# EAGLE board trig3_board_de0-nano_lvds (EAGLE 9.6.2), part 1 of 2
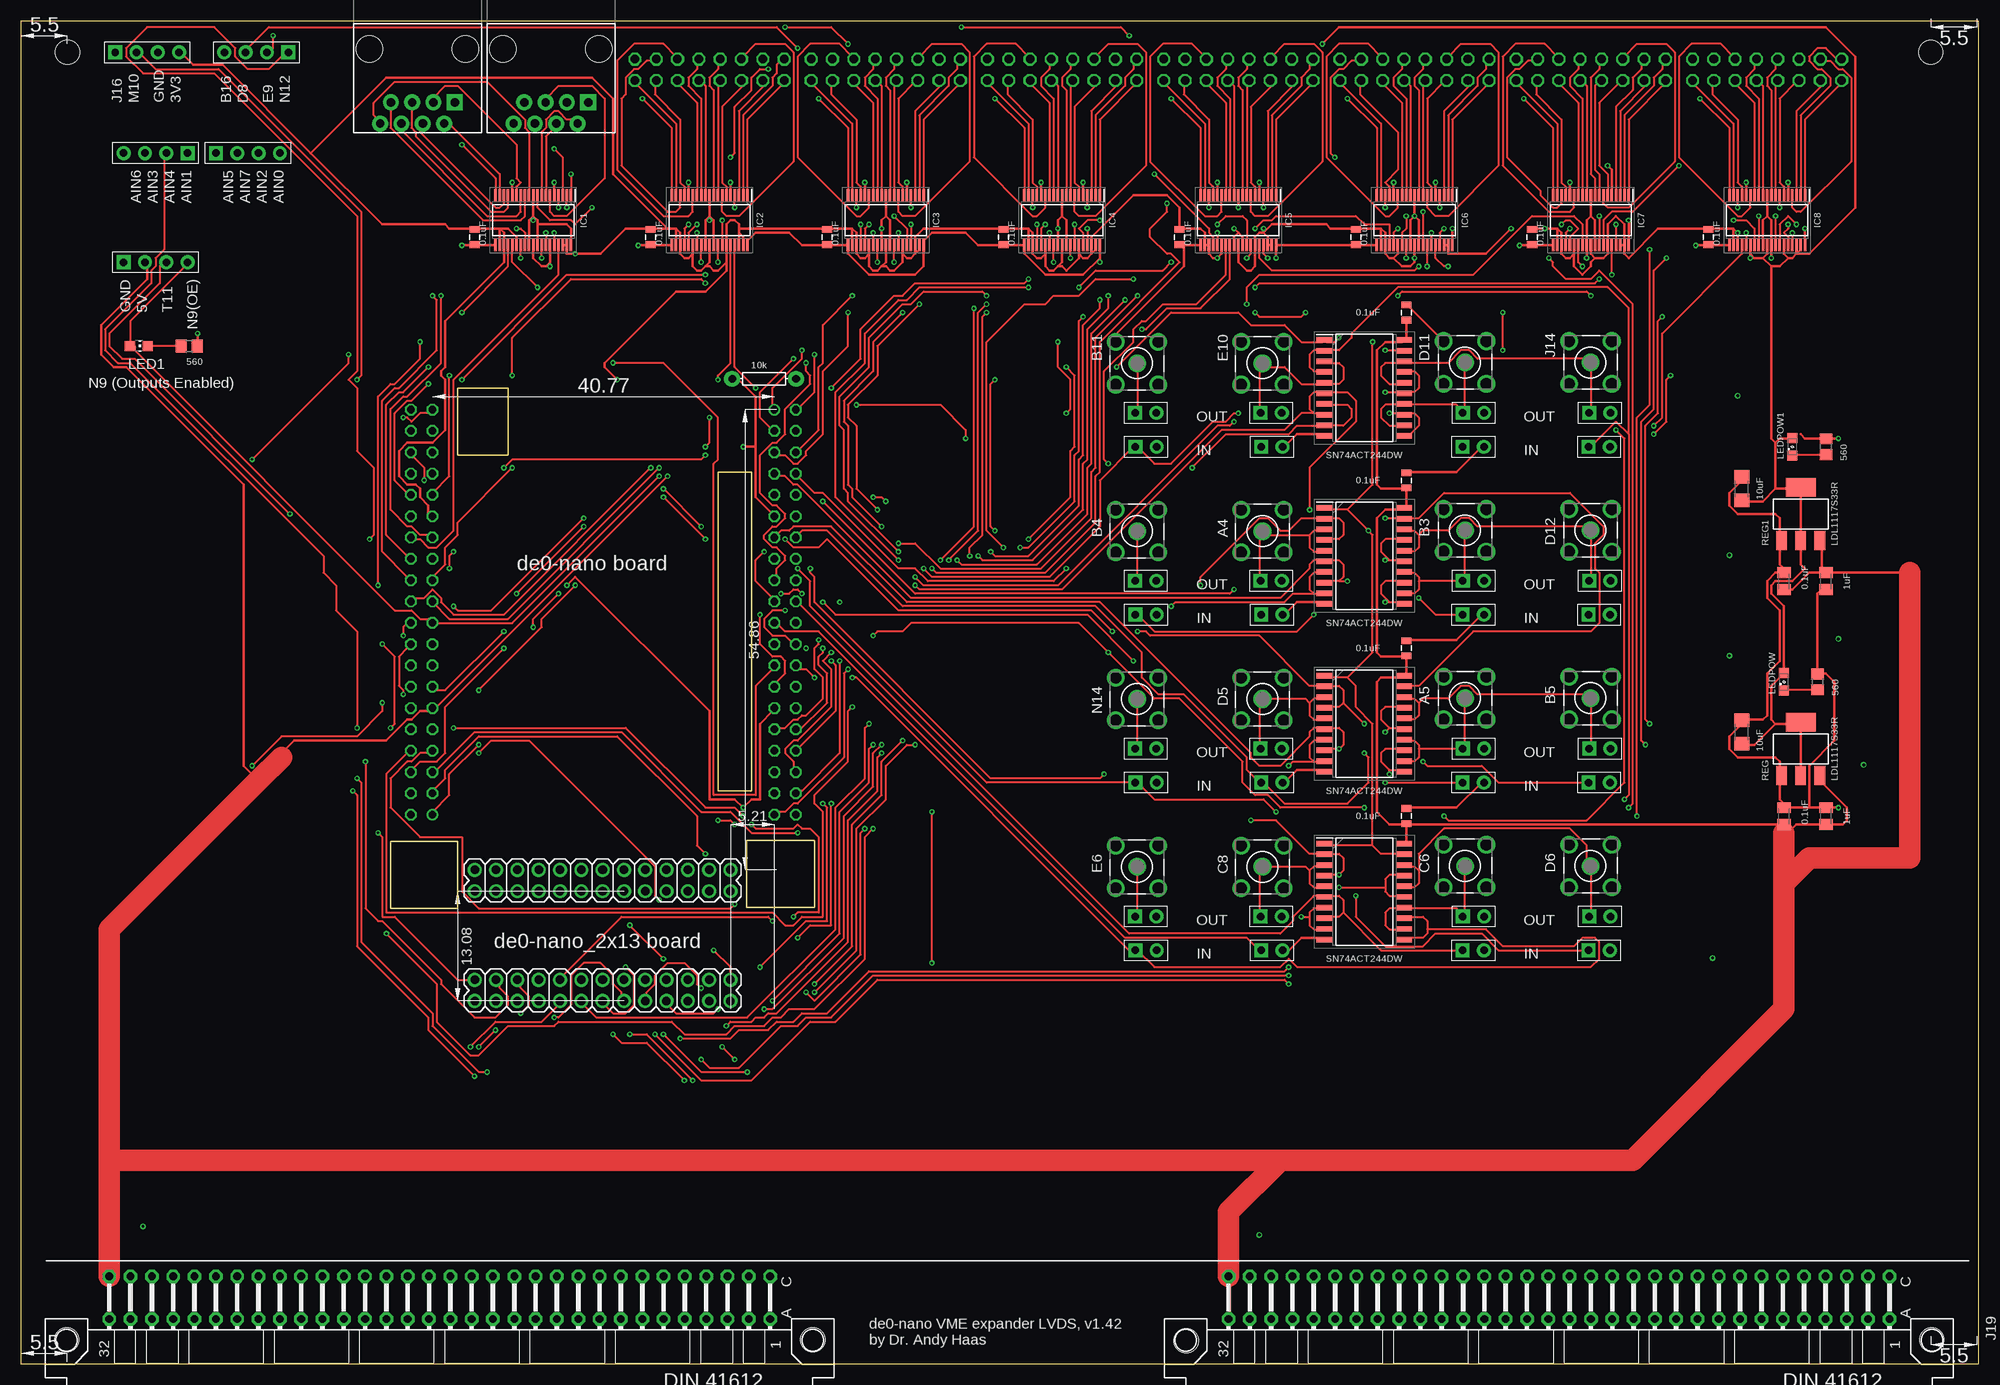
[diagram p2: board, top side]
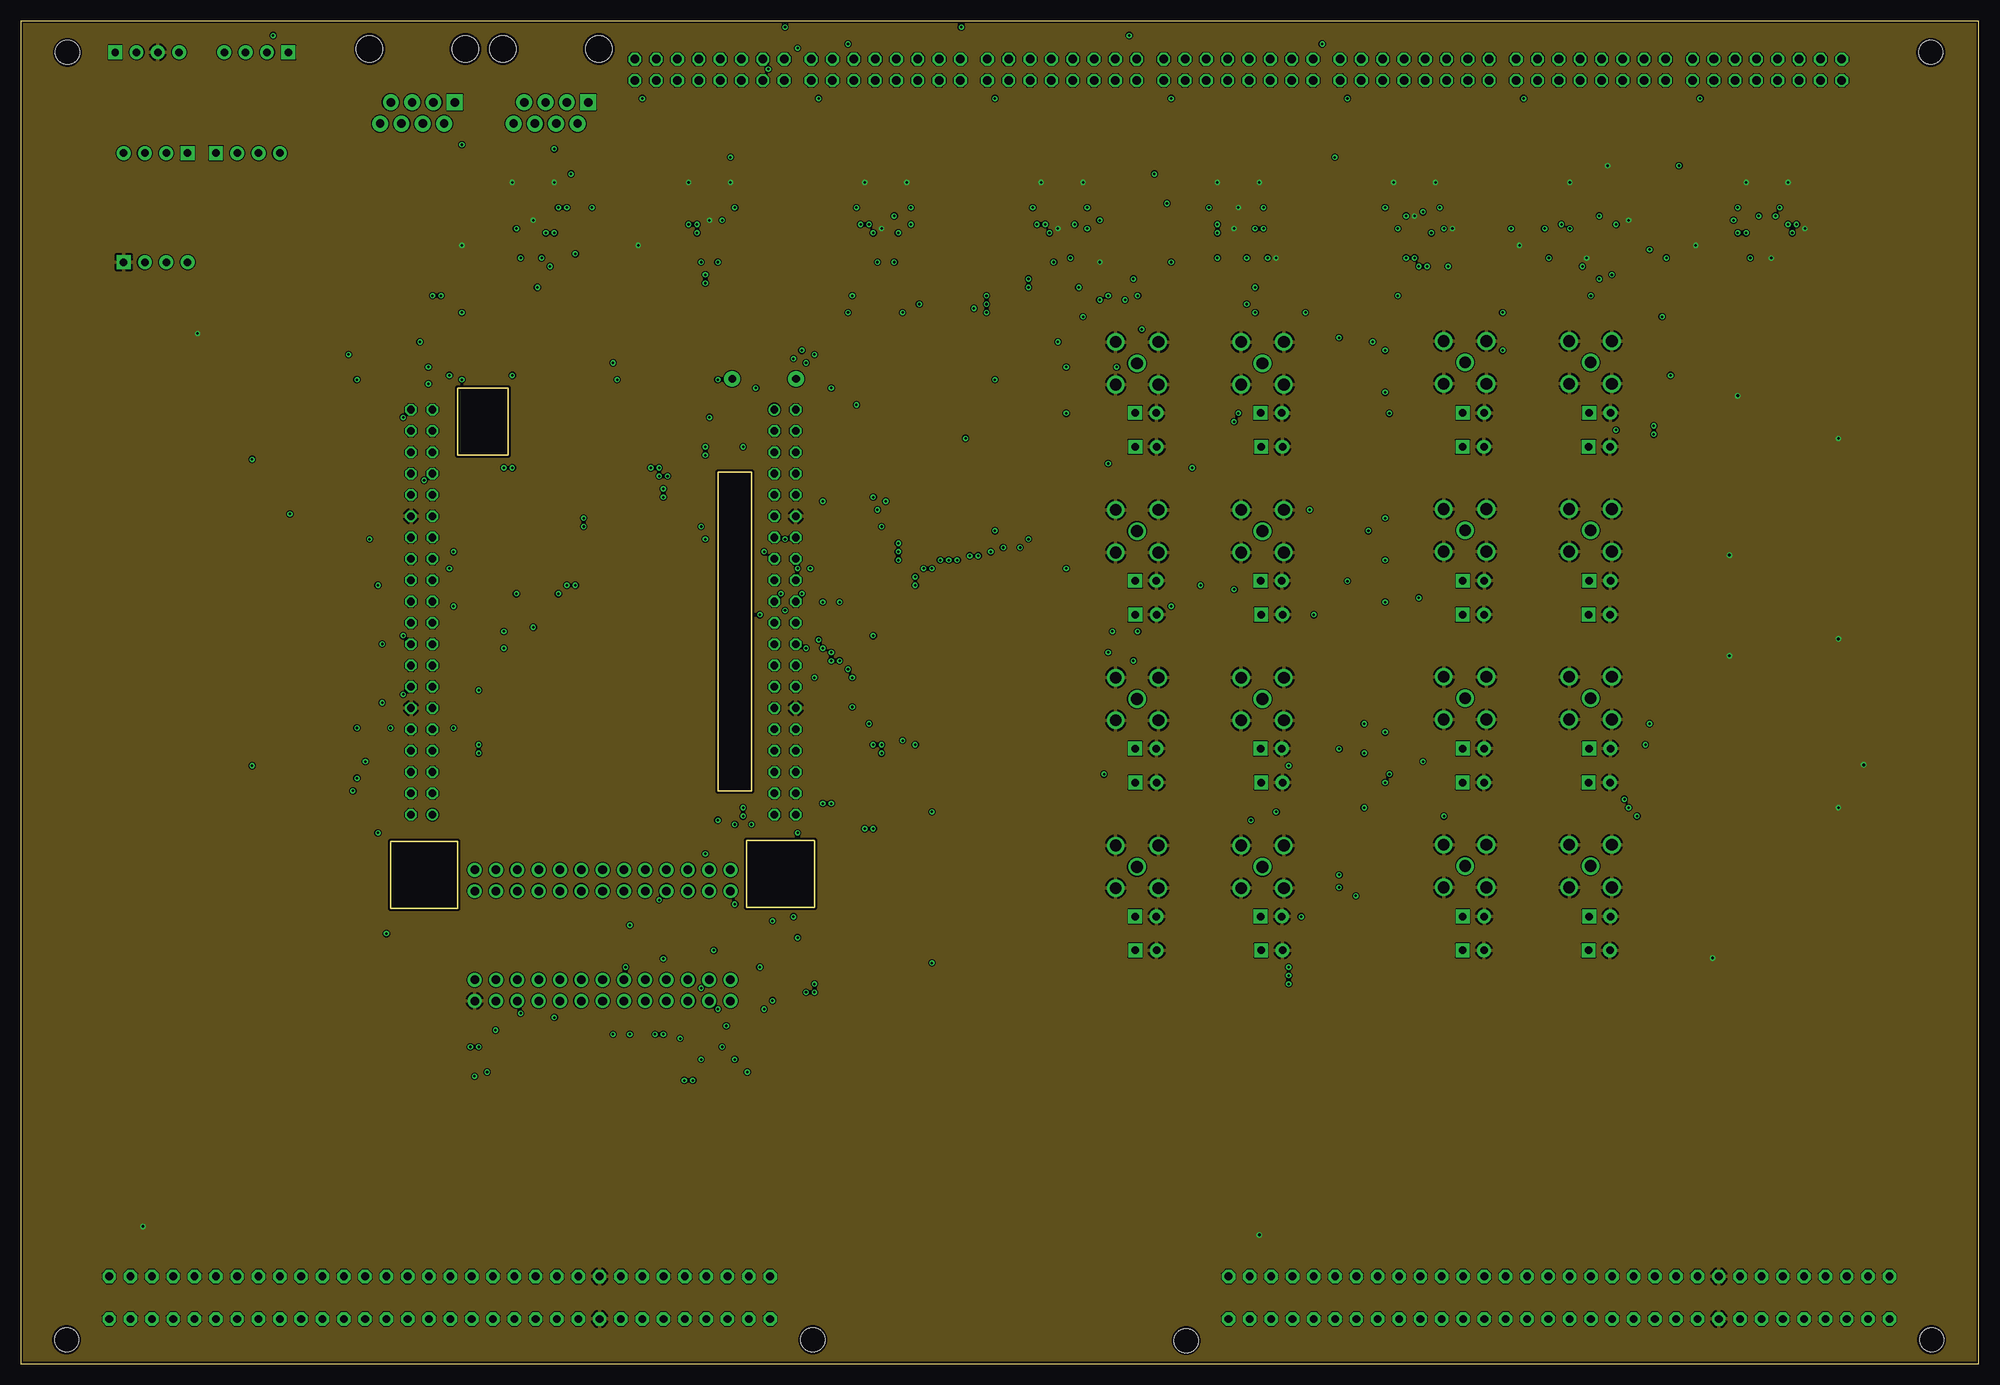
[diagram p3: board, inner layer Route2]
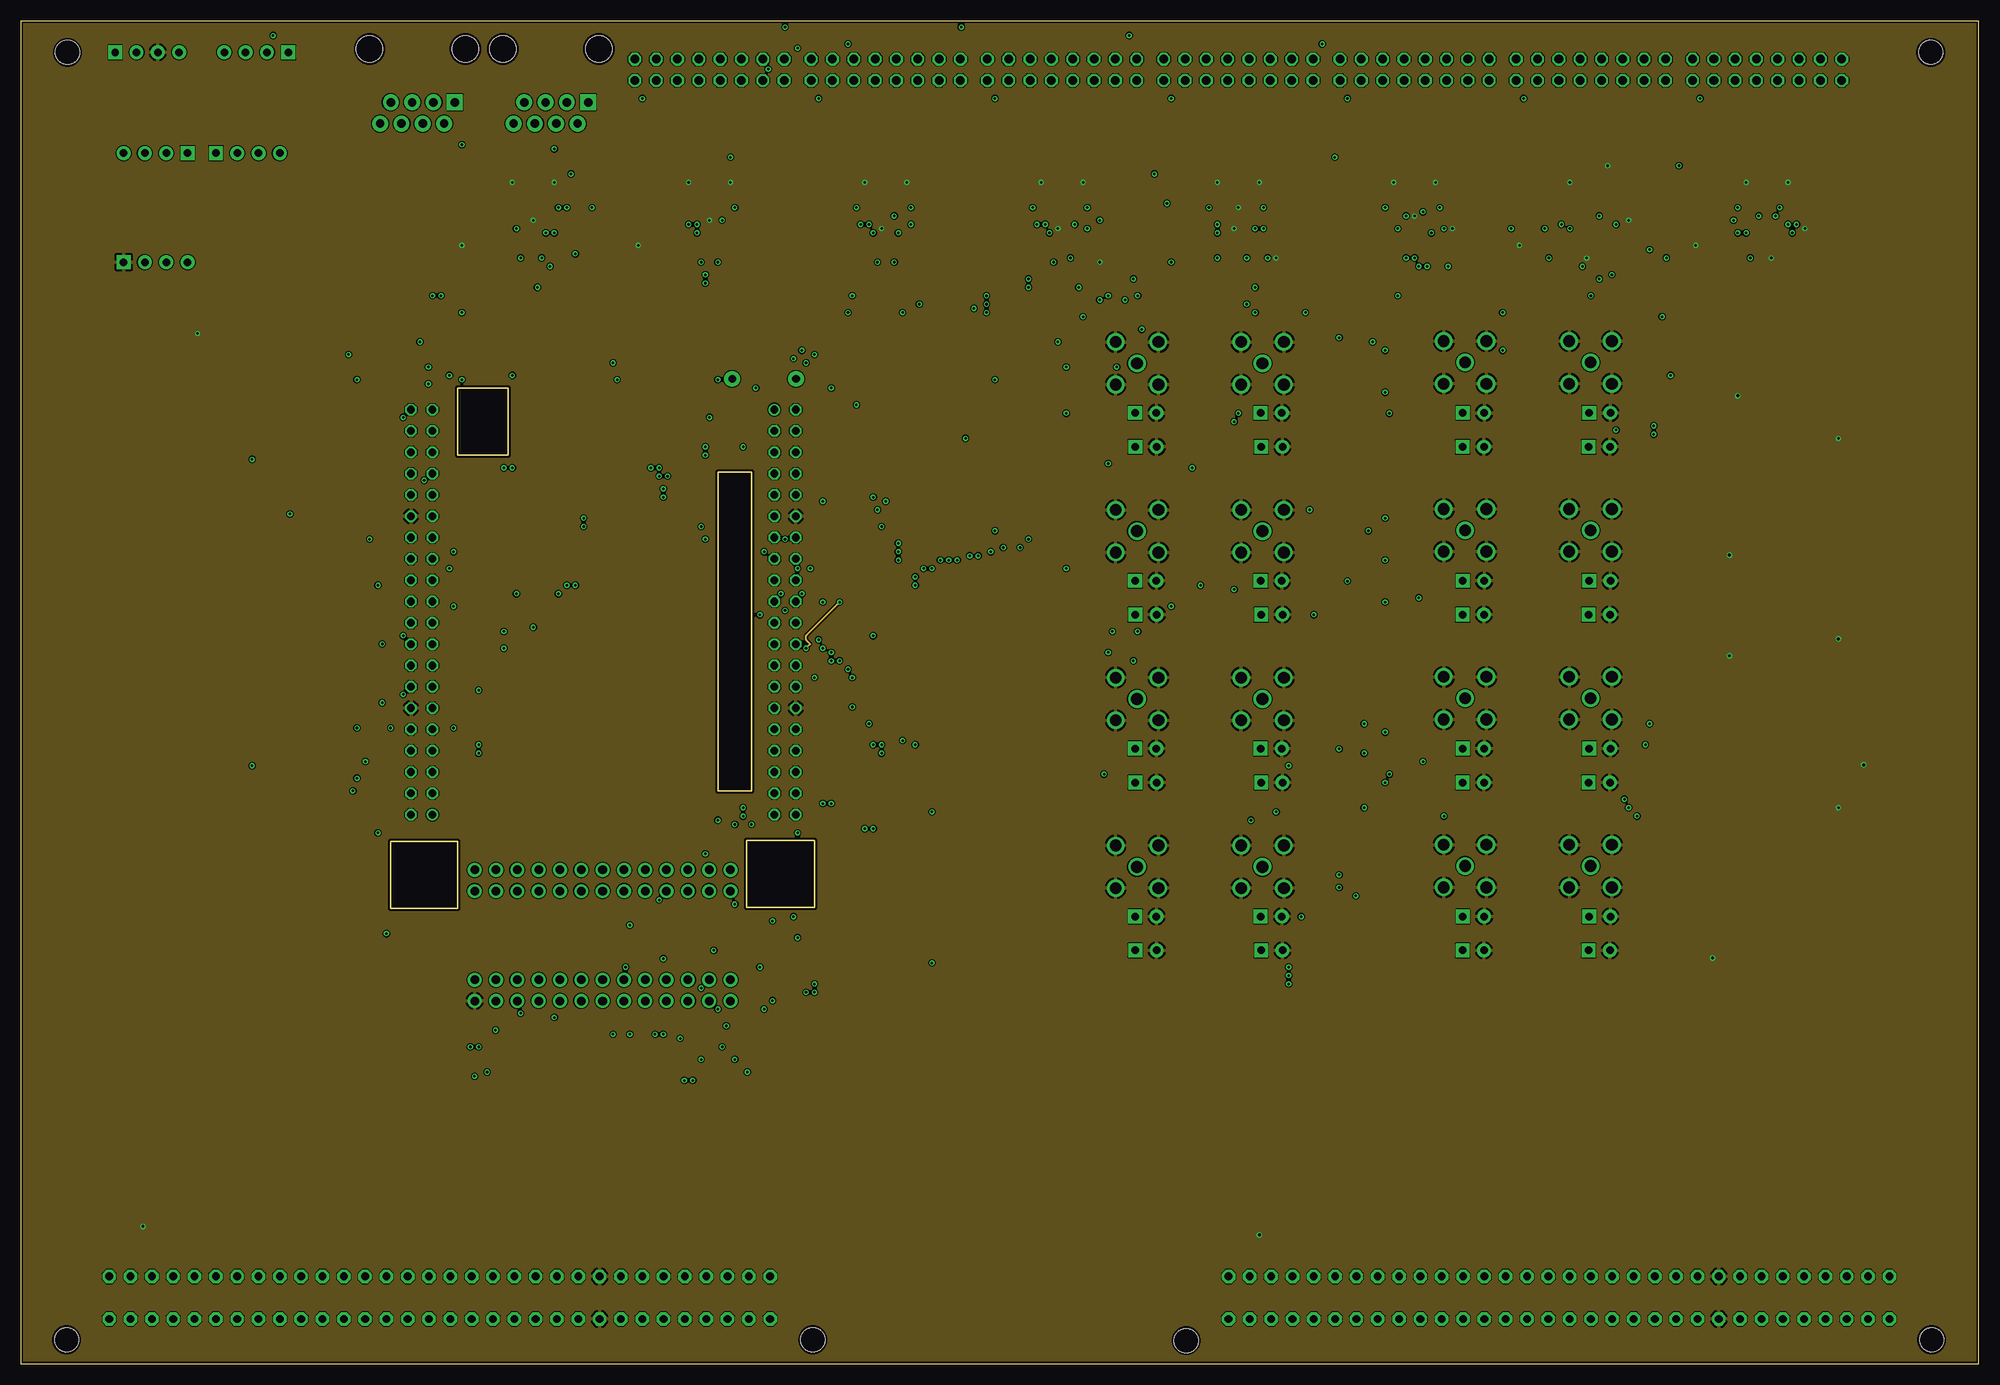
[diagram p4: board, inner layer Route15]
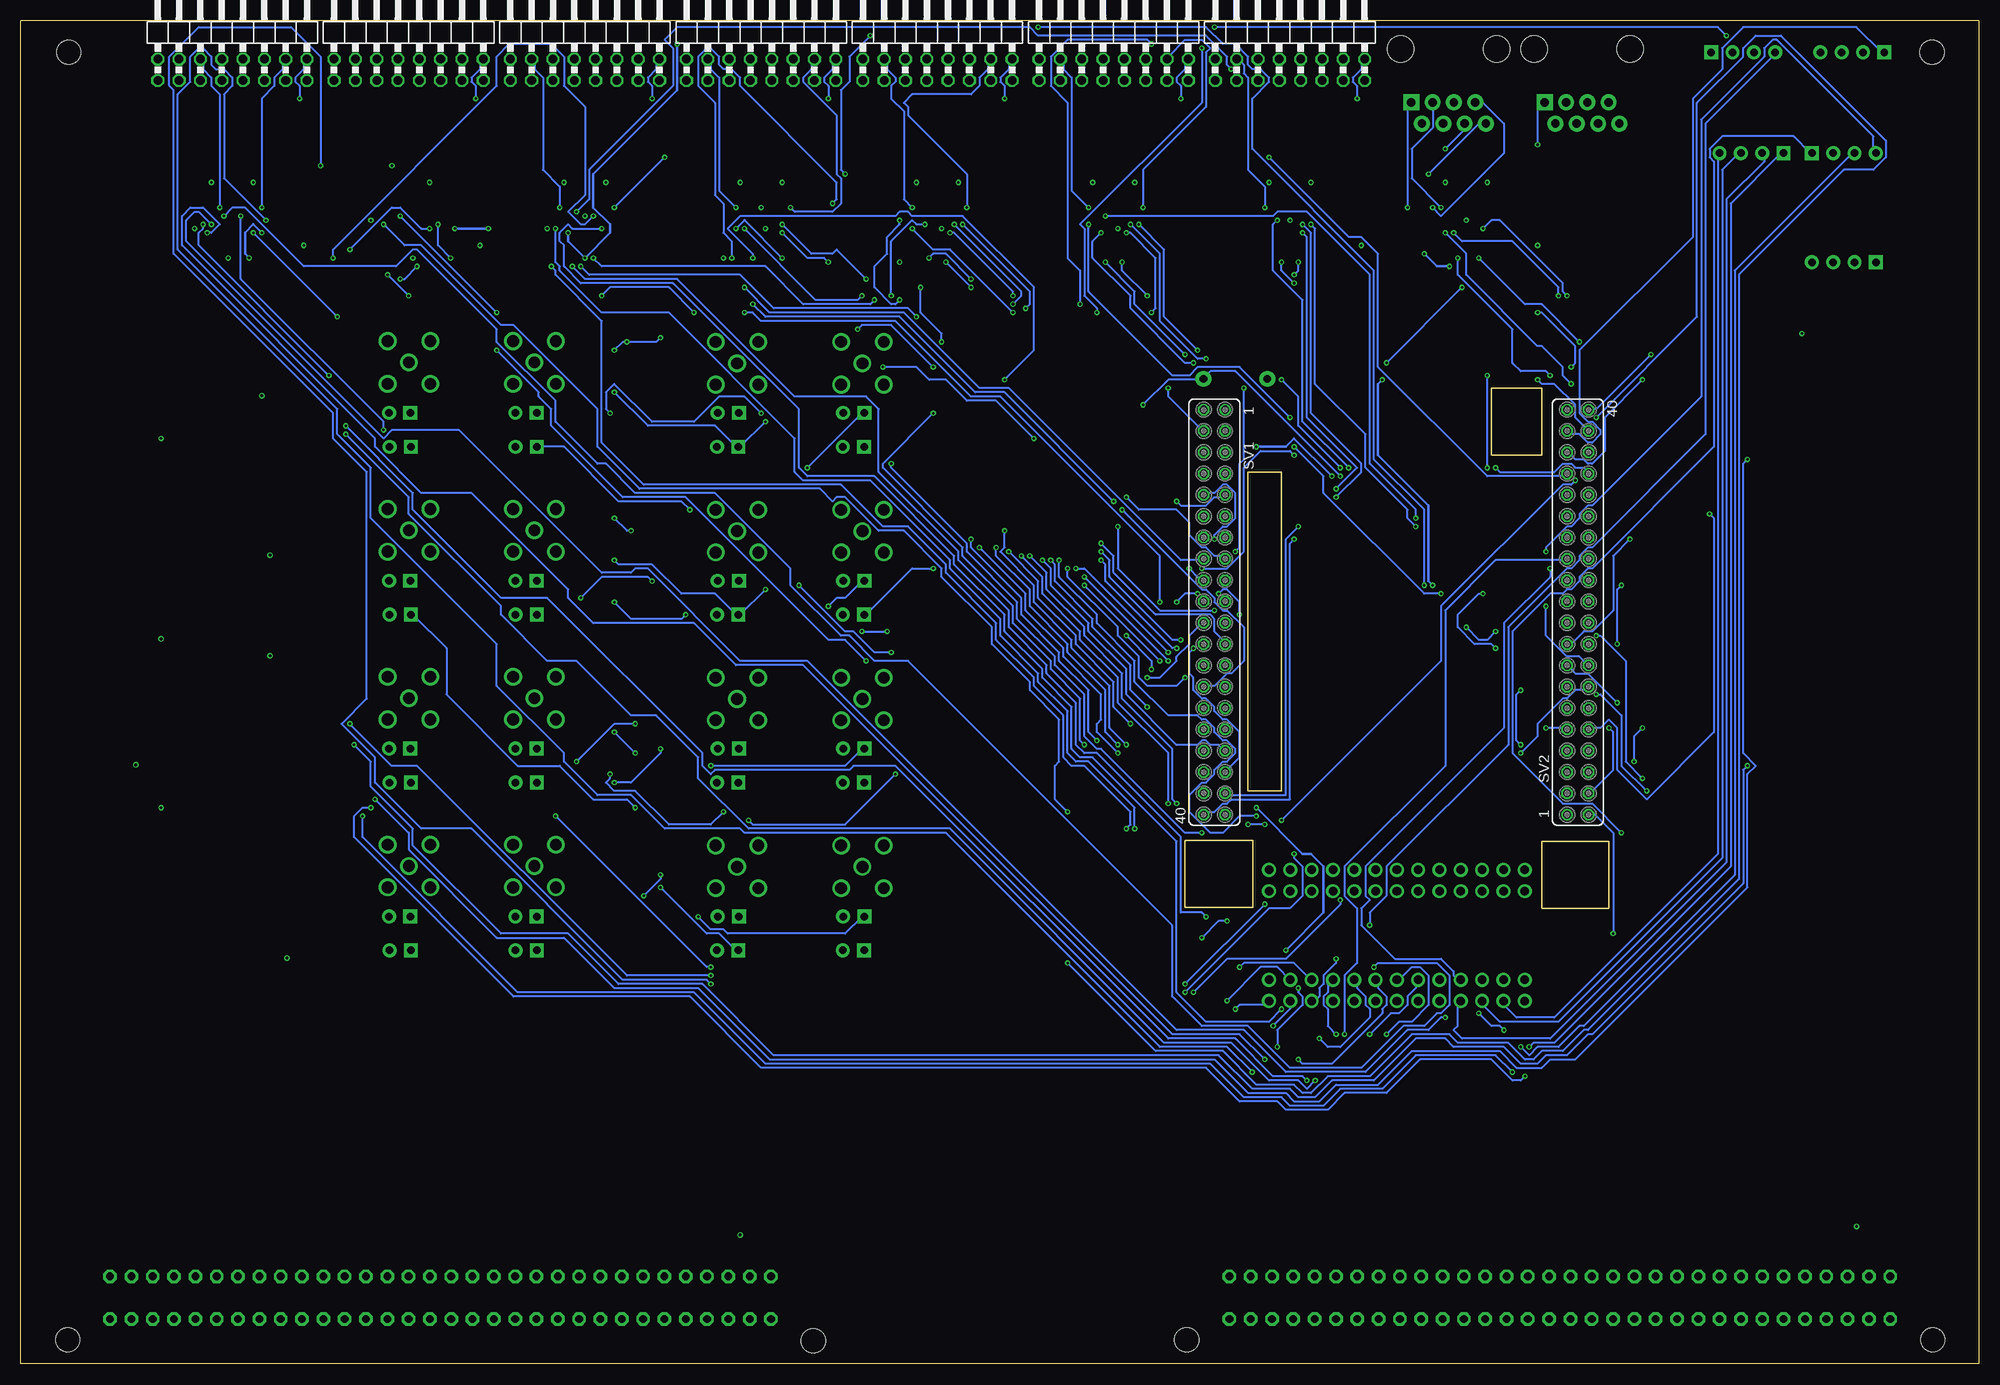
[diagram p5: board, bottom side, seen from below]

Size 233.22 x 160 mm. Coordinates in mm from the lower left corner, seen from the top.
Outline: 94.54,62.36 94.54,54.36 86.44,54.36 86.44,62.36 94.54,62.36
Outline: 52.04,62.26 52.04,54.26 44.04,54.26 44.04,62.26 52.04,62.26
Outline: 87.04,106.26 87.04,68.26 83.04,68.26 83.04,106.26 87.04,106.26
Outline: 52.04,108.26 52.04,116.26 58.04,116.26 58.04,108.26 52.04,108.26
Copper layers (1*2*15*16): Top 0.035mm / dielectric 0.23mm / Route2 0.035mm / dielectric 0.93mm / Route15 0.035mm / dielectric 0.23mm / Bottom 0.035mm
Design rules "MF_Standard_4_Layer": minimum track width 5mil, minimum drill 12mil, track to track 5mil, track to pad 5mil, pad to pad 5mil, via to via 5mil, smd to smd 0mil, copper to edge 10mil, drill to drill 10mil, minimum pad ring 6mil, minimum via ring 6mil, stop-mask expansion 2mil, vias tented up to drill 25mil, thermal gap 10mil
Net classes: 0 default: width 0.254 mm; 1 power: width 0.305 mm
Holes 2.9 mm at 5.44,2.86 138.84,2.76 227.64,2.86 94.34,2.86 5.54,156.26 227.54,156.26

## Footprints (pad centres in the part's own frame; a part is rotated, then mirrored left to right if it is on the bottom)
BU-SMB-V = drill 1.4: 1 0,0; 2 -2.54,2.54; 3 2.54,2.54; 4 2.54,-2.54; 5 -2.54,-2.54
0805 = smd 0.8 x 1.2: 1 -0.9,0; 2 0.9,0
C1206 = smd 1.6 x 1.8: 1 -1.4,0; 2 1.4,0
C0805K = smd 1.3 x 1.6: 1 -1,0; 2 1,0
SOP50P640X120-38N = smd 1.475 x 0.3: 1 -2.938,4.5; 2 -2.938,4; 3 -2.938,3.5; 4 -2.938,3; 5 -2.938,2.5; 6 -2.938,2; 7 -2.938,1.5; 8 -2.938,1; 9 -2.938,0.5; 10 -2.938,0; 11 -2.938,-0.5; 12 -2.938,-1; 13 -2.938,-1.5; 14 -2.938,-2; 15 -2.938,-2.5; 16 -2.938,-3; 17 -2.938,-3.5; 18 -2.938,-4; 19 -2.938,-4.5; 20 2.938,-4.5; 21 2.938,-4; 22 2.938,-3.5; 23 2.938,-3; 24 2.938,-2.5; 25 2.938,-2; 26 2.938,-1.5; 27 2.938,-1; 28 2.938,-0.5; 29 2.938,0; 30 2.938,0.5; 31 2.938,1; 32 2.938,1.5; 33 2.938,2; 34 2.938,2.5; 35 2.938,3; 36 2.938,3.5; 37 2.938,4; 38 2.938,4.5
2X13 = drill 1.016 pad 1.651: 1 0,0; 2 0,2.54; 3 2.54,0; 4 2.54,2.54; 5 5.08,0; 6 5.08,2.54; 7 7.62,0; 8 7.62,2.54; 9 10.16,0; 10 10.16,2.54; 11 12.7,0; 12 12.7,2.54; 13 15.24,0; 14 15.24,2.54; 15 17.78,0; 16 17.78,2.54; 17 20.32,0; 18 20.32,2.54; 19 22.86,0; 20 22.86,2.54; 21 25.4,0; 22 25.4,2.54; 23 27.94,0; 24 27.94,2.54; 25 30.48,0; 26 30.48,2.54
H4-2.54 = drill 0.889 pad 1.651 square: 1 0,3.81 | drill 0.889 pad 1.651: 2 0,1.27; 3 0,-1.27; 4 0,-3.81
RJ45-8 = drill 1 pad 1.88 square: 1 -4.445,6.35 | drill 1 pad 1.88: 2 -3.175,8.89; 3 -1.905,6.35; 4 -0.635,8.89; 5 0.635,6.35; 6 1.905,8.89; 7 3.175,6.35; 8 4.445,8.89 | hole 3.2: -5.715,0; 5.715,0
6HE_160-VG64AC = drill 0.914 pad 1.6 octagon: 1-A1 5.08,11.43; 1-A2 5.08,16.51; 1-A3 5.08,13.97; 1-A4 5.08,19.05; 1-A5 5.08,21.59; 1-A6 5.08,24.13; 1-A7 5.08,26.67; 1-A8 5.08,29.21; 1-A9 5.08,31.75; 1-A10 5.08,34.29; 1-A11 5.08,36.83; 1-A12 5.08,39.37; 1-A13 5.08,41.91; 1-A14 5.08,44.45; 1-A15 5.08,46.99; 1-A16 5.08,49.53; 1-A17 5.08,52.07; 1-A18 5.08,54.61; 1-A19 5.08,57.15; 1-A20 5.08,59.69; 1-A21 5.08,62.23; 1-A22 5.08,64.77; 1-A23 5.08,67.31; 1-A24 5.08,69.85; 1-A25 5.08,72.39; 1-A26 5.08,74.93; 1-A27 5.08,77.47; 1-A28 5.08,80.01; 1-A29 5.08,82.55; 1-A30 5.08,85.09; 1-A31 5.08,87.63; 1-A32 5.08,90.17; 1-C1 10.16,11.43; 1-C2 10.16,13.97; 1-C3 10.16,16.51; 1-C4 10.16,19.05; 1-C5 10.16,21.59; 1-C6 10.16,24.13; 1-C7 10.16,26.67; 1-C8 10.16,29.21; 1-C9 10.16,31.75; 1-C10 10.16,34.29; 1-C11 10.16,36.83; 1-C12 10.16,39.37; 1-C13 10.16,41.91; 1-C14 10.16,44.45; 1-C15 10.16,46.99; 1-C16 10.16,49.53; 1-C17 10.16,52.07; 1-C18 10.16,54.61; 1-C19 10.16,57.15; 1-C20 10.16,59.69; 1-C21 10.16,62.23; 1-C22 10.16,64.77; 1-C23 10.16,67.31; 1-C24 10.16,69.85; 1-C25 10.16,72.39; 1-C26 10.16,74.93; 1-C27 10.16,77.47; 1-C28 10.16,80.01; 1-C29 10.16,82.55; 1-C30 10.16,85.09; 1-C31 10.16,87.63; 1-C32 10.16,90.17; 2-A1 5.08,144.78; 2-A2 5.08,147.32; 2-A3 5.08,149.86; 2-A4 5.08,152.4; 2-A5 5.08,154.94; 2-A6 5.08,157.48; 2-A7 5.08,160.02; 2-A8 5.08,162.56; 2-A9 5.08,165.1; 2-A10 5.08,167.64; 2-A11 5.08,170.18; 2-A12 5.08,172.72; 2-A13 5.08,175.26; 2-A14 5.08,177.8; 2-A15 5.08,180.34; 2-A16 5.08,182.88; 2-A17 5.08,185.42; 2-A18 5.08,187.96; 2-A19 5.08,190.5; 2-A20 5.08,193.04; 2-A21 5.08,195.58; 2-A22 5.08,198.12; 2-A23 5.08,200.66; 2-A24 5.08,203.2; 2-A25 5.08,205.74; 2-A26 5.08,208.28; 2-A27 5.08,210.82; 2-A28 5.08,213.36; 2-A29 5.08,215.9; 2-A30 5.08,218.44; 2-A31 5.08,220.98; 2-A32 5.08,223.52; 2-C1 10.16,144.78; 2-C2 10.16,147.32; 2-C3 10.16,149.86; 2-C4 10.16,152.4; 2-C5 10.16,154.94; 2-C6 10.16,157.48; 2-C7 10.16,160.02; 2-C8 10.16,162.56; 2-C9 10.16,165.1; 2-C10 10.16,167.64; 2-C11 10.16,170.18; 2-C12 10.16,172.72; 2-C13 10.16,175.26; 2-C14 10.16,177.8; 2-C15 10.16,180.34; 2-C16 10.16,182.88; 2-C17 10.16,185.42; 2-C18 10.16,187.96; 2-C19 10.16,190.5; 2-C20 10.16,193.04; 2-C21 10.16,195.58; 2-C22 10.16,198.12; 2-C23 10.16,200.66; 2-C24 10.16,203.2; 2-C25 10.16,205.74; 2-C26 10.16,208.28; 2-C27 10.16,210.82; 2-C28 10.16,213.36; 2-C29 10.16,215.9; 2-C30 10.16,218.44; 2-C31 10.16,220.98; 2-C32 10.16,223.52
2X08/90 = drill 1.016 octagon: 1 -8.89,-6.35; 2 -8.89,-3.81; 3 -6.35,-6.35; 4 -6.35,-3.81; 5 -3.81,-6.35; 6 -3.81,-3.81; 7 -1.27,-6.35; 8 -1.27,-3.81; 9 1.27,-6.35; 10 1.27,-3.81; 11 3.81,-6.35; 12 3.81,-3.81; 13 6.35,-6.35; 14 6.35,-3.81; 15 8.89,-6.35; 16 8.89,-3.81
CHIP-LED0805 = smd 1.2 x 1.2: A 0,-1.05; C 0,1.05
SML0805 = smd 1.2 x 1.2: A 1.05,0; C -1.05,0
H2-2.54 = drill 0.889 pad 1.651 square: 1 0,1.27 | drill 0.889 pad 1.651: 2 0,-1.27
R0805 = smd 1.3 x 1.5: 1 -0.95,0; 2 0.95,0
AXIAL-0.3 = drill 0.9 pad 1.88: P$1 -3.81,0; P$2 3.81,0
SOT-223 = smd 1.27 x 2.286: 1 -2.286,-3.175; 2 0,-3.175; 3 2.286,-3.175 | smd 3.556 x 2.159: TER 0,3.175
FE20-2 = drill 0.914: 1 -24.13,1.27 | drill 0.914 octagon: 2 -24.13,-1.27; 3 -21.59,1.27; 4 -21.59,-1.27; 5 -19.05,1.27; 6 -19.05,-1.27; 7 -16.51,1.27; 8 -16.51,-1.27; 9 -13.97,1.27; 10 -13.97,-1.27; 11 -11.43,1.27; 12 -11.43,-1.27; 13 -8.89,1.27; 14 -8.89,-1.27; 15 -6.35,1.27; 16 -6.35,-1.27; 17 -3.81,1.27; 18 -3.81,-1.27; 19 -1.27,1.27; 20 -1.27,-1.27; 21 1.27,1.27; 22 1.27,-1.27; 23 3.81,1.27; 24 3.81,-1.27; 25 6.35,1.27; 26 6.35,-1.27; 27 8.89,1.27; 28 8.89,-1.27; 29 11.43,1.27; 30 11.43,-1.27; 31 13.97,1.27; 32 13.97,-1.27; 33 16.51,1.27; 34 16.51,-1.27; 35 19.05,1.27; 36 19.05,-1.27; 37 21.59,1.27; 38 21.59,-1.27; 39 24.13,1.27; 40 24.13,-1.27
SOIC127P1030X265-20N = smd 1.95 x 0.65: 1 -4.725,5.715; 2 -4.725,4.445; 3 -4.725,3.175; 4 -4.725,1.905; 5 -4.725,0.635; 6 -4.725,-0.635; 7 -4.725,-1.905; 8 -4.725,-3.175; 9 -4.725,-4.445; 10 -4.725,-5.715; 11 4.725,-5.715; 12 4.725,-4.445; 13 4.725,-3.175; 14 4.725,-1.905; 15 4.725,-0.635; 16 4.725,0.635; 17 4.725,1.905; 18 4.725,3.175; 19 4.725,4.445; 20 4.725,5.715

## Placement (x,y rotation side)
A4  BU-SMB-V  [BU-SMB-V]  147.92,99.21 180 top
A5  BU-SMB-V  [BU-SMB-V]  172.05,79.31 0 top
B3  BU-SMB-V  [BU-SMB-V]  172.05,99.31 0 top
B4  BU-SMB-V  [BU-SMB-V]  132.97,99.21 180 top
B5  BU-SMB-V  [BU-SMB-V]  187,79.31 0 top
B11  BU-SMB-V  [BU-SMB-V]  132.97,119.21 180 top
C1  0.1uF  [0805]  54.04,134.26 90 top
C2  0.1uF  [0805]  96.04,134.26 90 top
C3  0.1uF  [0805]  75.04,134.26 90 top
C4  0.1uF  [0805]  117.04,134.26 90 top
C5  0.1uF  [0805]  165.04,85.26 270 top
C6  BU-SMB-V  [BU-SMB-V]  172.05,59.31 0 top
C7  0.1uF  [0805]  138.04,134.26 90 top
C8  BU-SMB-V  [BU-SMB-V]  147.92,59.21 180 top
C9  0.1uF  [0805]  159.04,134.26 90 top
C10  0.1uF  [0805]  165.04,105.26 270 top
C11  0.1uF  [0805]  180.04,134.26 90 top
C12  0.1uF  [0805]  201.04,134.26 90 top
C91  0.1uF  [0805]  165.04,125.26 270 top
C97  0.1uF  [0805]  165.04,65.26 270 top
CP1  10uF  [C1206]  205.04,104.26 90 top
CP2  0.1uF  [C0805K]  210.04,65.26 90 top
CP3  0.1uF  [C0805K]  210.04,93.26 90 top
CP4  1uF  [C0805K]  215.04,93.26 90 top
CP6  10uF  [C1206]  205.04,75.26 90 top
CP11  1uF  [C0805K]  215.04,65.26 270 top
D5  BU-SMB-V  [BU-SMB-V]  147.92,79.21 180 top
D6  BU-SMB-V  [BU-SMB-V]  187,59.31 0 top
D11  BU-SMB-V  [BU-SMB-V]  172.05,119.31 0 top
D12  BU-SMB-V  [BU-SMB-V]  187,99.31 0 top
E6  BU-SMB-V  [BU-SMB-V]  132.97,59.21 180 top
E10  BU-SMB-V  [BU-SMB-V]  147.92,119.21 180 top
IC1  SN65LVDT388ADBT  [SOP50P640X120-38N]  61.04,136.26 270 top
IC2  SN65LVDT388ADBT  [SOP50P640X120-38N]  82.04,136.26 270 top
IC3  SN65LVDT388ADBT  [SOP50P640X120-38N]  103.04,136.26 270 top
IC4  SN65LVDT388ADBT  [SOP50P640X120-38N]  124.04,136.26 270 top
IC5  SN65LVDT388ADBT  [SOP50P640X120-38N]  145.04,136.26 270 top
IC6  SN65LVDT388ADBT  [SOP50P640X120-38N]  166.04,136.26 270 top
IC7  SN65LVDT388ADBT  [SOP50P640X120-38N]  187.04,136.26 270 top
IC8  SN65LVDT388ADBT  [SOP50P640X120-38N]  208.04,136.26 270 top
J1  16  [2X13]  84.54,45.76 180 top
J2  16  [2X13]  84.54,58.86 180 top
J3  4p-2.54  [H4-2.54]  16.04,131.26 90 top
J4  4p-2.54  [H4-2.54]  28.04,156.26 270 top
J5  RJ45  [RJ45-8]  63.14,156.66 180 top
J6  RJ45  [RJ45-8]  47.24,156.66 180 top
J12  4p-2.54  [H4-2.54]  15.04,156.26 90 top
J14  BU-SMB-V  [BU-SMB-V]  187,119.31 0 top
J19  6HE-160-VG64AC  [6HE_160-VG64AC]  234.04,0.26 90 top
J131  4p-2.54  [H4-2.54]  27.04,144.26 90 top
J311  4p-2.54  [H4-2.54]  16.04,144.26 270 top
JP2  16  [2X08/90]  82.04,159.26 0 bottom
JP3  16  [2X08/90]  103.04,159.26 0 bottom
JP4  16  [2X08/90]  124.04,159.26 0 bottom
JP5  16  [2X08/90]  145.04,159.26 0 bottom
JP6  16  [2X08/90]  166.04,159.26 0 bottom
JP7  16  [2X08/90]  187.04,159.26 0 bottom
JP8  16  [2X08/90]  208.04,159.26 0 bottom
LED1  red  [CHIP-LED0805]  14.04,121.26 270 top
LEDPOW  MF-LED-0805-RED  [SML0805]  210.04,81.26 90 top
LEDPOW1  MF-LED-0805-RED  [SML0805]  211.04,109.26 90 top
N14  BU-SMB-V  [BU-SMB-V]  132.97,79.21 180 top
OJ1  2p-2.54  [H2-2.54]  188.11,113.3 90 top
OJ2  2p-2.54  [H2-2.54]  173.06,113.3 90 top
OJ3  2p-2.54  [H2-2.54]  134,113.3 90 top
OJ4  2p-2.54  [H2-2.54]  148.95,113.3 90 top
OJ5  2p-2.54  [H2-2.54]  149.04,109.26 90 top
OJ6  2p-2.54  [H2-2.54]  134.04,109.26 90 top
OJ7  2p-2.54  [H2-2.54]  188.04,109.26 90 top
OJ8  2p-2.54  [H2-2.54]  173.04,109.26 90 top
OJ49  2p-2.54  [H2-2.54]  148.95,53.3 90 top
OJ50  2p-2.54  [H2-2.54]  134,53.3 90 top
OJ51  2p-2.54  [H2-2.54]  173.06,53.3 90 top
OJ52  2p-2.54  [H2-2.54]  188.11,53.3 90 top
OJ53  2p-2.54  [H2-2.54]  149.04,49.26 90 top
OJ54  2p-2.54  [H2-2.54]  134.04,49.26 90 top
OJ55  2p-2.54  [H2-2.54]  188.04,49.26 90 top
OJ56  2p-2.54  [H2-2.54]  173.04,49.26 90 top
OJ65  2p-2.54  [H2-2.54]  148.95,73.3 90 top
OJ66  2p-2.54  [H2-2.54]  134,73.3 90 top
OJ67  2p-2.54  [H2-2.54]  173.06,73.3 90 top
OJ68  2p-2.54  [H2-2.54]  188.11,73.3 90 top
OJ69  2p-2.54  [H2-2.54]  149.04,69.26 90 top
OJ70  2p-2.54  [H2-2.54]  134.04,69.26 90 top
OJ71  2p-2.54  [H2-2.54]  188.04,69.26 90 top
OJ72  2p-2.54  [H2-2.54]  173.04,69.26 90 top
OJ89  2p-2.54  [H2-2.54]  148.95,93.3 90 top
OJ90  2p-2.54  [H2-2.54]  134,93.3 90 top
OJ91  2p-2.54  [H2-2.54]  173.06,93.3 90 top
OJ92  2p-2.54  [H2-2.54]  188.11,93.3 90 top
OJ93  2p-2.54  [H2-2.54]  149.04,89.26 90 top
OJ94  2p-2.54  [H2-2.54]  134.04,89.26 90 top
OJ95  2p-2.54  [H2-2.54]  188.04,89.26 90 top
OJ96  2p-2.54  [H2-2.54]  173.04,89.26 90 top
R8  560  [R0805]  20.04,121.26 0 top
R17  10k  [AXIAL-0.3]  88.54,117.36 0 top
REG  LDL1117S33R  [SOT-223]  212.04,73.26 0 top
REG1  LDL1117S33R  [SOT-223]  212.04,101.26 0 top
RLEDPOW  560  [R0805]  214.04,81.26 90 top
RLEDPOW1  560  [R0805]  215.04,109.26 90 top
SV1  1  [FE20-2]  91.04,89.56 270 bottom
SV2  2  [FE20-2]  47.74,89.56 90 bottom
VSLUE  SN74ACT244DW  [SOIC127P1030X265-20N]  160.04,116.26 0 top
VSLUE6  SN74ACT244DW  [SOIC127P1030X265-20N]  160.04,56.26 0 top
VSLUE8  SN74ACT244DW  [SOIC127P1030X265-20N]  160.04,76.26 0 top
VSLUE11  SN74ACT244DW  [SOIC127P1030X265-20N]  160.04,96.26 0 top

## Tracks (layer width: path | path; a pad name or v marks a point on that pad's centre or on a via)
3V3  (via drill 0.3)
  Top 0.305: 209.04,76.26 208.54,76.76 208.54,80.76 210.04,82.26 LEDPOW.A 210.04,90.26 208.54,91.76 208.54,92.76 209.04,93.26 211.04,93.26 212.54,94.76 212.04,95.26 REG1.2 212.04,103.76 212.54,104.26 212.04,104.76 REG1.TER 212.04,104.26 209.04,104.26 | 209.04,76.26 212.04,76.26 REG.TER 212.04,76.76 212.54,76.26 212.04,75.76 REG.2 | 209.04,76.26 206.54,73.76 205.04,73.76 CP6.1 | 209.04,104.26 207.54,102.76 205.04,102.76 CP1.1 | 209.04,109.76 209.04,104.26 | 209.04,109.76 209.54,110.26 211.04,110.26 LEDPOW1.A | 57.04,135.26 54.04,135.26 | 57.04,135.26 57.54,134.76 IC1.22 57.54,131.26 50.54,124.26 50.54,118.76 50.04,118.26 50.04,117.76 50.54,117.26 50.54,111.26 49.04,109.76 46.04,109.76 45.04,108.76 45.04,105.76 46.04,104.76 47.04,104.76 47.54,104.26 47.54,103.26 48.54,102.26 48.54,101.26 SV2.29 | 57.04,135.26 IC1.21 | IC1.25 59.04,134.26 58.04,135.26 57.04,135.26 | 34.54,144.26 43.04,135.76 50.54,135.76 51.04,135.26 54.04,135.26 | 34.54,144.26 24.04,154.76 20.54,154.76 19.04,156.26 J12.4 | 54.04,135.26 C1.2 | 206.04,132.26 IC8.25 | 206.04,132.26 206.54,131.76 207.54,131.76 | 207.54,131.76 208.04,132.26 IC8.29 | IC8.33 210.04,132.26 210.54,131.76 | 210.54,131.76 211.04,131.76 211.54,132.26 | IC8.36 211.54,132.26 | IC8.37 212.04,132.76 211.54,132.26 | 208.54,130.76 207.54,131.76 | 208.54,130.76 209.54,130.76 210.54,131.76 | 208.54,130.76 208.54,110.26 209.04,109.76 | 170.04,133.26 169.54,133.26 IC6.36 | 183.04,135.26 v181.54,135.26 180.04,135.26 C11.2 | 183.04,135.26 183.54,134.76 IC7.22 183.54,132.26 184.04,131.76 184.54,131.76 185.04,132.26 | 183.04,135.26 IC7.21 | 185.04,132.26 IC7.25
  Top 0.305: 170.04,133.26 170.04,132.26 174.54,132.26 v177.54,135.26 | 170.04,133.26 IC6.37 | 204.04,135.26 201.04,135.26 | 204.04,135.26 v204.54,134.76 IC8.22 | 204.04,135.26 IC8.21 | 191.04,133.26 190.54,133.26 IC7.36 | IC7.29 187.04,132.26 187.54,131.76 | 187.54,131.76 188.54,131.76 189.04,132.26 IC7.33 189.04,135.76 190.04,136.76 191.04,135.76 IC7.37 191.04,133.26 | 201.04,135.26 195.04,135.26 191.54,131.76 191.04,132.26 191.04,133.26 | 201.04,135.26 C12.2 | 185.04,132.26 185.04,130.76 186.04,129.76 187.04,130.76 187.04,131.26 187.54,131.76 | v206.04,131.76 206.04,132.26 | IC5.37 149.04,133.26 148.54,133.26 IC5.36 148.54,134.26 148.04,134.76 | IC5.29 145.04,131.26 146.04,130.26 146.54,130.26 147.04,130.76 IC5.33 147.04,134.26 147.54,134.76 148.04,134.76 | 162.04,135.26 159.04,135.26 | 162.04,135.26 162.54,134.76 IC6.22 162.54,132.26 163.04,131.76 163.54,131.76 | 162.04,135.26 IC6.21 | IC6.25 164.04,132.26 163.54,131.76 | IC6.29 v166.04,131.76 166.04,131.26 165.54,130.76 164.54,130.76 163.54,131.76 | v168.04,134.76 IC6.33 | 148.04,134.76 149.04,135.76 155.54,135.76 156.04,135.26 159.04,135.26 | 159.04,135.26 C9.2 | 138.04,135.26 140.54,135.26 141.04,134.76 IC5.21 141.04,133.26 141.54,133.26 | IC5.25 143.04,132.26 v142.54,131.76 142.04,131.76 141.54,132.26 141.54,133.26 | 141.54,133.26 IC5.22 | 126.04,132.26 IC4.33 | 126.04,132.26 126.54,131.76 127.04,131.76 127.54,132.26 | 127.54,132.26 128.04,132.76 IC4.37 | 127.54,132.26 IC4.36 127.54,134.26 132.54,139.26 136.54,139.26 138.04,137.76 138.04,135.26 | 120.04,135.26 117.04,135.26 | 120.04,135.26 120.54,134.76 IC4.22 120.54,132.26 121.04,131.76 121.54,131.76 122.04,132.26
  Top 0.305: 120.04,135.26 IC4.21 | 122.04,132.26 IC4.25 | IC4.29 124.04,131.26 123.54,130.76 | 123.54,130.76 123.04,130.26 122.54,130.26 122.04,130.76 122.04,132.26 | 126.04,132.26 126.04,131.76 124.54,130.26 124.04,130.76 123.54,130.76 | 138.04,135.26 C7.2 | v148.04,135.26 148.04,134.76 | v82.54,49.26 84.54,47.26 J1.1 | SV1.29 89.54,77.76 88.04,76.26 88.04,67.26 87.04,67.26 v86.04,66.26 85.04,67.26 82.04,67.26 82.04,77.76 66.04,93.76 v65.04,92.76 | 105.04,132.26 IC3.33 | 105.04,132.26 105.54,131.76 106.04,131.76 106.54,132.26 | 106.54,132.26 107.04,132.76 IC3.37 | 106.54,132.26 IC3.36 106.54,134.26 107.54,135.26 117.04,135.26 | 99.04,135.26 96.04,135.26 | 99.04,135.26 99.54,134.76 IC3.22 99.54,132.26 100.04,131.76 100.54,131.76 101.04,132.26 | 99.04,135.26 IC3.21 | 101.04,132.26 IC3.25 | IC3.29 103.04,131.26 102.54,130.76 | 102.54,130.76 102.04,130.26 101.54,130.26 101.04,130.76 101.04,132.26 | 105.04,132.26 105.04,131.26 104.04,130.26 103.54,130.26 103.04,130.76 102.54,130.76 | IC2.36 85.54,134.76 | 85.54,134.76 85.54,135.26 | 85.54,135.26 85.54,135.76 85.04,136.26 84.54,136.26 84.04,135.76 IC2.33 84.04,131.26 | IC2.37 86.04,134.26 85.54,134.76 | IC1.29 61.04,131.76 62.04,130.76 62.54,130.76 | 62.54,130.76 63.04,131.26 IC1.33 | 65.04,133.26 64.54,133.26 IC1.36 | 78.04,135.26 77.04,135.26 | 77.04,135.26 75.04,135.26 | 78.04,135.26 78.54,134.76 IC2.22 78.54,132.26 79.04,131.76 79.54,131.76 80.04,132.26 | 78.04,135.26 IC2.21 | 80.04,132.26 IC2.25 | IC2.29 82.04,131.26 81.54,130.76 | 81.54,130.76 81.04,130.26 80.54,130.26 80.04,130.76 80.04,132.26 | 65.04,133.26 65.04,132.26 v66.04,132.26 69.04,132.26 72.04,135.26 75.04,135.26
  Top 0.305: 65.04,133.26 IC1.37 | 75.04,135.26 C3.2 | v63.04,130.76 62.54,130.76 | 84.04,131.26 83.04,130.26 82.54,130.26 82.04,130.76 81.54,130.76 | 85.54,135.26 96.04,135.26 | 96.04,135.26 C2.2 | v71.04,117.26 69.54,118.76 69.54,119.26 78.04,127.76 81.54,127.76 84.04,130.26 84.04,131.26 | 117.04,135.26 C4.2 | 211.54,132.26 213.04,132.26 218.54,137.76 218.54,155.76 215.04,159.26 157.04,159.26 v155.04,157.26 | 34.54,144.26 43.54,153.26 68.04,153.26 70.54,150.76 70.54,141.76 77.04,135.26
  Bottom 0.305: v181.54,135.26 v177.54,135.26 | v206.04,131.76 206.54,132.26 206.54,134.76 205.54,135.76 v204.54,134.76 | v168.04,134.76 168.04,133.76 v166.04,131.76 163.04,134.76 163.04,135.76 165.04,137.76 165.04,141.76 155.04,151.76 v155.04,157.26 | v148.04,135.26 147.04,136.26 v142.54,131.76 | v86.04,66.26 80.54,60.76 79.54,60.76 78.04,59.26 78.04,53.76 v82.54,49.26 | v63.04,130.76 64.54,130.76 v66.04,132.26 | v65.04,92.76 65.54,93.26 65.54,102.26 71.54,108.26 71.54,116.76 v71.04,117.26
5V  (via drill 0.3)
  Top 0.305: CP3.1 211.04,92.26 213.04,94.26 214.54,94.26 | 214.54,94.26 214.54,97.76 REG1.3 | 214.54,94.26 CP4.2 225.04,94.26 | REG.3 214.54,69.76 214.54,69.26 217.54,66.26 217.54,64.76 217.04,64.26 CP11.2 211.54,64.26 211.04,63.76 210.04,63.26 CP2.1 165.04,64.26 | J19.2-A32 10.54,5.76 10.54,9.26 J19.2-C32 | J19.1-A32 144.04,5.76 144.04,9.26 J19.1-C32 | C91.2 165.04,122.26 VSLUE.20 164.54,121.76 162.54,121.76 161.54,120.76 161.54,104.76 162.04,104.26 165.04,104.26 | 165.04,104.26 165.04,102.26 VSLUE11.20 164.54,101.76 162.54,101.76 161.54,100.76 161.54,84.76 162.04,84.26 165.04,84.26 | 165.04,64.26 165.04,62.26 VSLUE6.20 | 165.04,84.26 165.04,82.26 VSLUE8.20 164.54,81.76 162.04,81.76 161.54,81.26 161.54,65.76 163.04,64.26 165.04,64.26 | 165.04,84.26 C5.2 | 165.04,104.26 C10.2 | 87.54,109.26 87.54,115.26 85.04,117.76 R17.P$1 | 87.54,109.26 87.54,103.26 89.54,101.26 SV1.11 | 31.04,72.26 31.54,73.26 32.54,74.26 43.54,74.26 46.04,76.76 46.54,76.76 47.54,77.76 48.54,77.76 SV2.11 49.04,77.76 v77.04,105.76 | 28.29,69.51 26.54,71.26 26.54,104.76 12.54,118.76 11.04,118.76 9.54,120.26 9.54,123.76 15.04,129.26 15.04,131.26 J3.2 | v86.04,109.26 87.54,109.26 | 165.04,64.26 C97.2
  Top 2.54: J19.2-C32 10.52,24.26 | J19.1-C32 143.87,18.09 150.04,24.26 | 210.04,57.26 210.04,42.26 192.04,24.26 150.04,24.26 | 210.04,57.26 210.04,63.26 | 210.04,57.26 213.04,60.26 225.04,60.26 225.04,94.26 | 10.52,24.26 150.04,24.26 | 10.52,24.26 10.52,51.74 28.29,69.51 31.04,72.26
  Bottom 0.305: v86.04,109.26 82.54,109.26 81.54,110.26 v77.04,105.76
AIN0
  Bottom 0.254: J1.24 56.54,42.76 55.04,41.26 50.54,41.26 31.04,60.76 31.04,144.26 J131.4
AIN1  (via drill 0.3)
  Top 0.254: J1.25 52.04,45.76 44.54,53.26 43.04,53.26 43.04,62.76 v42.54,63.26
  Bottom 0.254: v42.54,63.26 46.04,66.76 49.54,66.76 55.54,72.76 55.54,87.26 51.04,91.76 49.54,91.76 49.04,92.26 48.54,92.26 47.54,93.26 47.54,93.76 46.54,94.76 46.04,94.76 31.54,109.26 31.54,143.26 32.04,143.76 32.04,144.76 30.54,146.26 22.04,146.26 20.04,144.26 J311.1
AIN2
  Bottom 0.254: J1.22 59.04,42.76 57.04,40.76 50.04,40.76 30.54,60.26 30.54,142.26 28.54,144.26 J131.3
AIN3  (via drill 0.3)
  Top 0.254: v59.54,41.76 60.54,42.76 60.54,43.76 59.54,44.76 59.54,45.76 J1.21 | v54.54,37.76 v56.54,39.76
  Bottom 0.254: v59.54,41.76 58.04,40.26 57.04,40.26 v56.54,39.76 | v54.54,37.76 53.54,36.76 52.54,37.76 50.04,37.76 47.54,40.26 47.04,40.26 29.04,58.26 29.04,130.26 15.04,144.26 J311.3
AIN4  (via drill 0.3)
  Top 0.254: v41.04,71.76 41.04,54.26 42.54,52.76 43.04,52.76 50.04,45.76 50.04,45.26 54.04,41.26 56.54,41.26 58.04,42.76 58.04,43.76 57.04,44.76 57.04,45.76 J1.23 | v40.04,75.76 40.04,87.26 37.54,89.76 37.54,92.76 36.04,94.26 36.04,96.26 13.04,119.26 11.54,119.26 10.04,120.76 10.04,123.26 15.54,128.76 15.54,130.26 16.04,130.76 16.04,131.76 17.04,132.76 17.04,144.26 J311.2
  Bottom 0.254: v41.04,71.76 41.04,74.76 v40.04,75.76
AIN5  (via drill 0.3)
  Top 0.254: v53.54,37.76 56.54,40.76 62.04,40.76 64.04,42.76 J1.18
  Bottom 0.254: v53.54,37.76 53.04,38.26 50.54,38.26 29.54,59.26 29.54,138.26 23.54,144.26 J131.1
AIN6  (via drill 0.3)
  Top 0.254: v51.04,94.76 51.04,96.26 v51.54,96.76
  Bottom 0.254: v51.04,94.76 51.04,93.76 56.54,88.26 56.54,75.76 73.04,59.26 73.04,55.76 72.54,55.26 73.54,54.26 73.54,52.26 69.54,48.26 64.04,48.26 62.54,46.76 62.54,46.26 62.04,45.76 J1.19 | v51.54,96.76 51.54,97.26 49.04,99.76 48.54,99.76 47.54,100.76 47.54,101.26 46.54,102.26 46.04,102.26 33.04,115.26 33.04,148.26 25.54,155.76 25.54,156.76 24.54,157.76 24.04,157.76 12.54,146.26 12.54,144.26 J311.4
AIN7
  Bottom 0.254: J1.20 62.04,42.76 62.04,40.26 62.54,39.76 61.54,38.76 51.04,38.76 30.04,59.76 30.04,138.76 25.54,143.26 25.54,144.26 J131.2
GND  (via drill 0.3, 0.35)
  Top 0.305: CP1.2 205.04,105.26 203.54,103.76 203.54,102.26 204.54,101.26 209.04,101.26 209.54,100.76 209.54,98.26 REG1.1 209.54,97.76 209.54,95.26 210.04,94.76 CP3.2 209.04,94.26 208.04,93.26 208.04,91.26 209.54,89.76 209.54,83.76 208.04,82.26 208.04,77.26 207.54,76.76 205.04,76.76 CP6.2 205.04,76.26 203.54,74.76 203.54,73.26 204.54,72.26 209.04,72.26 209.54,71.76 209.54,70.26 REG.1 209.54,69.76 209.54,67.26 210.04,66.76 CP2.2 213.04,66.26 | 214.04,82.26 214.04,91.76 214.54,92.26 CP4.1 | 213.04,66.26 CP11.1 v216.54,66.26 | 214.04,82.26 215.04,82.26 216.04,81.26 216.04,74.26 213.04,71.26 213.04,66.26 | 214.04,82.26 RLEDPOW.2 | 212.04,110.76 212.54,110.26 215.04,110.26 | v216.54,110.26 215.04,110.26 | 215.04,110.26 RLEDPOW1.2 | 98.54,133.26 96.04,133.26 | 96.04,133.26 93.04,133.26 91.54,134.76 87.54,134.76 86.54,133.76 IC2.38 | 96.04,133.26 C2.1 | 119.54,133.26 117.04,133.26 | 117.04,133.26 114.04,133.26 112.54,134.76 108.54,134.76 107.54,133.76 IC3.38 107.54,130.76 106.54,129.76 101.04,129.76 98.54,132.26 98.54,133.26 | 117.04,133.26 C4.1 | 128.54,131.76 IC4.38 | 128.54,131.76 126.54,129.76 122.04,129.76 119.54,132.26 119.54,133.26 | 119.54,133.26 IC4.20 | 98.54,133.26 IC3.20 | 159.04,133.26 161.54,133.26 IC6.20 | 159.04,133.26 149.54,133.26 | 159.04,133.26 C9.1 | 60.54,136.26 IC1.28 | 61.04,136.76 60.54,136.26 | IC1.10 61.04,136.76 | 61.54,135.76 61.54,136.26 61.04,136.76 | 61.54,135.76 IC1.30 | IC1.38 65.54,135.26 65.04,135.76 61.54,135.76 | IC8.28 207.54,136.26 208.04,136.76 | IC8.10 208.04,136.76 | 208.04,136.76 208.54,136.26 IC8.30 v208.54,131.76 | 187.04,136.76 186.54,136.26 IC7.28 v186.54,131.76
  Top 0.305: IC7.10 187.04,136.76 | IC7.30 187.54,136.26 187.04,136.76 | IC6.28 165.54,136.26 v166.04,136.76 | IC6.10 v166.04,136.76 | IC6.30 166.54,136.26 v166.04,136.76 | IC4.28 v123.54,135.26 123.54,136.26 124.04,136.76 | IC4.10 124.04,136.76 | IC4.30 124.54,136.26 124.04,136.76 | IC3.28 v102.54,135.26 102.54,136.26 103.04,136.76 | IC3.10 103.04,136.76 | IC3.30 103.54,136.26 103.04,136.76 | 81.54,136.26 IC2.28 | 82.04,136.76 81.54,136.26 | IC2.10 82.04,136.76 | IC2.30 82.54,136.26 82.04,136.76 | 201.04,133.26 203.54,133.26 IC8.20 | 180.04,133.26 182.54,133.26 IC7.20 | 138.54,133.26 140.54,133.26 IC5.20 | 138.54,133.26 138.04,133.26 C7.1 138.54,133.26 | 75.04,133.26 77.54,133.26 IC2.20 | 54.04,133.26 56.54,133.26 IC1.20 | IC5.28 144.54,134.26 145.04,134.76 | 145.04,134.76 145.54,134.26 IC5.30 | C97.1 165.04,66.26 171.04,66.26 174.04,69.26 OJ72.2 | C5.1 165.04,86.26 171.04,86.26 174.04,89.26 OJ96.2 | C10.1 165.04,106.26 171.04,106.26 174.04,109.26 OJ8.2 | C91.1 165.04,126.26 169.04,122.26 D11.2 | v58.54,140.76 IC1.15 | v63.54,140.76 IC1.5 | v79.54,140.76 IC2.15 | v84.54,140.76 IC2.5 | v100.54,140.76 IC3.15 | v105.54,140.76 IC3.5 | v121.54,140.76 IC4.15 | v126.54,140.76 IC4.5 | v142.54,140.76 IC5.15 | v145.04,137.76 IC5.10 | v147.54,140.76 IC5.5 | v163.54,140.76 IC6.15 | v170.54,135.26 IC6.38 | v168.54,140.76 IC6.5 | v184.54,140.76 IC7.15 | v191.54,136.26 IC7.38 | IC7.5 189.54,142.26 v189.04,142.76 | v212.54,135.26 IC8.38 | v205.54,140.76 IC8.15 | v210.54,140.76 IC8.5 | v21.04,122.76 21.04,121.26 R8.2 | OJ53.2 151.04,49.26 152.54,50.76 155.04,50.76 VSLUE6.10 | VSLUE8.10 155.04,70.76 152.04,70.76 150.54,69.26 OJ69.2 | VSLUE11.10 155.04,90.76 152.04,90.76 150.54,89.26 OJ93.2
  Top 0.305: VSLUE.10 155.04,110.76 152.04,110.76 150.54,109.26 OJ5.2 | v144.54,135.26 145.04,134.76 | v52.54,133.26 54.04,133.26 | 54.04,133.26 C1.1 | v73.54,133.26 75.04,133.26 | 75.04,133.26 C3.1 | 138.54,133.26 138.54,130.76 130.04,122.26 130.04,121.76 B11.4 | v178.54,133.26 180.04,133.26 | 180.04,133.26 C11.1 | v199.54,133.26 201.04,133.26 | 201.04,133.26 C12.1 | v82.04,136.26 81.54,136.26 | v61.04,136.26 60.54,136.26 | v149.54,131.76 149.54,133.26 | 149.54,133.26 IC5.38 | v128.54,131.26 128.54,131.76
  other vias: 14.54,16.36 147.54,15.36 216.54,86.36 219.54,71.36 203.54,84.36 203.54,96.36 204.54,115.36 201.54,48.36
  pour Route15: 237.04,162.26 237.04,-1.74 -1.96,-1.74 -1.96,162.26
  pour Route2: 236.04,163.26 236.04,-0.74 -2.96,-0.74 -2.96,163.26
GPIO_00_D3  (via drill 0.3)
  Top 0.254: v104.04,131.26 IC3.31 | v94.54,120.26 94.54,115.76 92.54,113.76 SV1.2
  Bottom 0.254: v104.04,131.26 100.54,127.76 100.54,126.26 v94.54,120.26
GPIO_0_IN0_A8CLK  (via drill 0.3)
  Top 0.254: v100.04,135.76 IC3.23 | v93.04,120.76 93.04,119.76 89.54,116.26 89.54,113.76 SV1.1
  Bottom 0.254: v100.04,135.76 97.04,132.76 97.04,124.76 v93.04,120.76
GPIO_0_IN1_B8CLK  (via drill 0.3)
  Top 0.254: IC3.24 100.54,135.26 v101.04,135.76 | v92.04,119.76 88.04,115.76 88.04,112.76 89.54,111.26 SV1.3
  Bottom 0.254: v101.04,135.76 97.54,132.26 97.54,124.26 93.04,119.76 v92.04,119.76
GPIO_01_C3  (via drill 0.3)
  Top 0.254: v125.04,131.76 IC4.31 | v120.04,129.26 119.54,128.76 106.54,128.76 105.04,127.26 104.04,127.26 100.04,123.26 100.04,119.76 v96.54,116.26
  Bottom 0.254: v125.04,131.76 124.54,132.26 123.04,132.26 v120.04,129.26 | v96.54,116.26 96.54,115.26 92.54,111.26 SV1.4
GPIO_1_IN0_T9CLK  (via drill 0.3)
  Top 0.254: IC5.23 142.04,134.26 141.54,134.76 141.54,135.26 v135.04,141.76 | v132.04,158.26 131.04,159.26 v112.04,159.26 | v66.04,92.76 62.04,88.76 62.04,87.76 v54.54,80.26 | v54.54,73.76 51.04,70.26 51.04,67.76 49.04,65.76 SV2.1
  Bottom 0.254: v135.04,141.76 135.54,142.26 135.54,151.76 134.54,152.76 134.54,155.76 v132.04,158.26 | v112.04,159.26 92.04,159.26 90.04,157.26 88.54,157.26 87.04,155.76 87.04,154.76 86.54,154.26 85.54,154.26 84.54,153.26 84.54,152.76 86.54,150.76 86.54,144.76 72.04,130.26 72.04,107.76 66.04,101.76 v66.04,92.76 | v54.54,80.26 55.04,79.76 55.04,74.26 v54.54,73.76
GPIO_1_IN1_R9CLK  (via drill 0.3)
  Top 0.254: v142.54,134.76 IC5.24 | v137.04,131.26 136.04,130.26 128.04,130.26 v126.04,128.26 | v123.54,121.76 123.54,118.76 125.04,117.26 125.04,113.76 v124.54,113.26 | v106.54,73.76 105.54,73.76 103.04,71.26 103.04,67.26 99.54,63.76 99.54,49.26 v94.54,44.26 | v81.54,60.76 80.54,61.76 80.54,65.26 71.04,74.76 54.54,74.76 50.54,70.76 50.54,69.76 49.04,68.26 SV2.3
  Bottom 0.254: v142.54,134.76 139.54,131.76 137.54,131.76 v137.04,131.26 | v126.04,128.26 126.04,125.26 123.54,122.76 v123.54,121.76 | v124.54,113.26 130.54,107.26 130.54,106.76 121.04,97.26 121.04,96.26 115.04,90.26 115.04,88.26 110.54,83.76 110.54,82.76 107.04,79.26 107.04,74.26 v106.54,73.76 | v94.54,44.26 84.54,54.26 82.04,54.26 80.54,55.76 80.54,59.26 81.54,60.26 v81.54,60.76
GPIO_02_A2  (via drill 0.3)
  Top 0.254: v101.54,134.76 IC3.26 | v98.54,125.26 98.54,121.26 95.54,118.26 95.54,110.76 93.54,108.76 93.54,108.26 92.54,107.26 92.04,107.26 91.04,108.26 90.04,108.26 SV1.5
  Bottom 0.254: v101.54,134.76 101.04,134.76 98.04,131.76 98.04,125.76 v98.54,125.26
GPIO_2_IN0_E15CLK  (via drill 0.3)
  Top 0.254: IC5.31 146.04,136.26 145.54,136.76 143.54,136.76 v142.54,135.76 | v132.54,129.26 128.04,129.26 126.04,127.26 123.04,127.26 122.04,126.26 119.54,126.26 115.04,121.76 115.04,99.26 v117.04,97.26 | v102.54,73.76 101.54,72.76 101.54,68.76 98.04,65.26 98.04,50.76 89.54,42.26 v88.54,42.26
  Bottom 0.254: v142.54,135.76 139.04,132.26 136.54,132.26 136.04,132.76 v132.54,129.26 | v117.04,97.26 117.04,96.26 113.04,92.26 113.04,90.26 108.54,85.76 108.54,84.76 104.04,80.26 104.04,75.26 v102.54,73.76 | v88.54,42.26 88.04,42.76 84.54,42.76 J1.2
GPIO_2_IN1_E16CLK  (via drill 0.3)
  Top 0.254: IC5.32 146.54,132.26 v146.04,131.76 | v116.04,117.26 115.54,116.76 115.54,99.76 v116.04,99.26 | v101.54,73.76 101.04,73.26 101.04,69.26 97.54,65.76 97.54,51.26 v89.54,43.26
  Bottom 0.254: v146.04,131.76 146.04,132.26 149.04,135.26 147.54,136.76 129.04,136.76 128.54,137.26 127.54,137.26 127.04,136.76 121.04,136.76 112.54,128.26 112.54,120.76 v116.04,117.26 | v116.04,99.26 116.04,97.26 116.54,96.76 112.54,92.76 112.54,90.76 108.04,86.26 108.04,85.26 103.54,80.76 103.54,75.76 v101.54,73.76 | v89.54,43.26 85.54,47.26 83.54,47.26 82.04,45.76 J1.3
GPIO_2_IN2_M16CLK  (via drill 0.3)
  Top 0.254: IC5.34 147.54,131.76 149.04,130.26 166.04,130.26 v166.54,130.76 | v126.54,124.76 126.04,124.26 126.04,108.76 125.54,108.26 125.54,102.76 120.04,97.26 v119.04,97.26 | v102.54,72.76 102.04,72.26 102.04,68.26 98.54,64.76 98.54,50.26 90.04,41.76 89.04,41.76 88.54,41.26 87.54,41.26 87.04,40.76 84.54,40.76 v84.04,40.26
  Bottom 0.254: v166.54,130.76 165.54,129.76 147.54,129.76 143.54,125.76 127.54,125.76 v126.54,124.76 | v119.04,97.26 113.54,91.76 113.54,89.76 109.04,85.26 109.04,84.26 104.54,79.76 104.54,76.76 105.04,76.26 105.04,75.26 v102.54,72.76 | v84.04,40.26 81.54,42.76 J1.4
GPIO_03_A3  (via drill 0.3)
  Top 0.254: v102.04,131.26 IC3.27 | v99.04,127.26 95.54,123.76 95.54,119.26 95.04,118.76 95.04,111.26 92.54,108.76 SV1.6
  Bottom 0.254: v102.04,131.26 102.04,130.26 v99.04,127.26
GPIO_04_B3  (via drill 0.3)
  Top 0.254: 157.04,93.26 155.54,93.26 VSLUE11.8 | 157.04,93.26 157.54,93.76 157.54,95.26 157.04,95.76 155.54,95.76 VSLUE11.6 155.04,95.76 154.04,95.76 153.54,95.26 153.54,94.76 150.04,91.26 106.04,91.26 92.54,104.76 92.04,104.76 91.04,105.76 90.04,105.76 SV1.7 | OJ96.1 168.54,89.26 v166.54,91.26 | 157.04,93.26 v158.04,93.26
  Bottom 0.254: v166.54,91.26 164.04,93.76 158.54,93.76 v158.04,93.26
GPIO_05_B4  (via drill 0.3)
  Top 0.254: 163.04,90.76 164.54,90.76 VSLUE11.11 | 163.04,90.76 162.04,91.76 162.04,92.76 162.54,93.26 164.54,93.26 VSLUE11.13 | v124.54,94.76 123.04,93.26 108.04,93.26 106.54,94.76 104.54,94.76 95.54,103.76 94.54,103.76 92.54,105.76 SV1.8 | v162.54,90.76 163.04,90.76 | v154.04,89.26 152.04,87.26 135.04,87.26 133.04,89.26 OJ94.1
  Bottom 0.254: v124.54,94.76 127.04,94.76 132.54,89.26 OJ94.1 | v162.54,90.76 160.54,88.76 154.54,88.76 v154.04,89.26
GPIO_06_A4  (via drill 0.3)
  Top 0.254: 163.04,95.76 164.54,95.76 VSLUE11.15 | 163.04,95.76 162.04,96.76 162.04,97.76 162.54,98.26 164.54,98.26 VSLUE11.17 | v95.54,102.76 106.54,91.76 144.04,91.76 v144.54,92.26 | v162.54,95.76 163.04,95.76
  Bottom 0.254: v95.54,102.76 95.04,102.26 92.04,102.26 91.04,103.26 90.04,103.26 SV1.9 | v144.54,92.26 147.54,89.26 OJ93.1 148.04,89.26 150.54,91.76 154.54,91.76 158.04,95.26 162.04,95.26 v162.54,95.76
GPIO_07_B5  (via drill 0.3)
  Top 0.254: 157.54,78.76 157.04,78.26 155.54,78.26 VSLUE8.4 | 157.54,78.76 157.54,80.26 157.04,80.76 155.54,80.76 VSLUE8.2 155.04,80.76 153.54,80.76 147.54,86.76 134.54,86.76 134.04,87.26 v133.04,87.26 | v91.04,98.26 92.04,97.26 95.04,97.26 96.04,98.26 104.54,89.76 127.54,89.76 v130.04,87.26 | OJ71.1 176.04,69.26 174.04,71.26 167.54,71.26 v167.04,71.76 | 157.54,78.76 v160.04,76.26
  Bottom 0.254: v91.04,98.26 91.04,98.76 90.04,99.76 89.54,99.76 88.54,100.76 88.54,103.76 89.54,104.76 90.04,104.76 91.04,103.76 92.04,103.76 SV1.10 | v133.04,87.26 v130.04,87.26 | v167.04,71.76 162.54,76.26 v160.04,76.26
GPIO_08_A5  (via drill 0.3)
  Top 0.254: VSLUE8.8 155.54,73.26 v157.04,73.26 157.54,73.76 157.54,75.26 157.04,75.76 155.54,75.76 VSLUE8.6 155.04,75.76 154.04,75.76 153.54,75.26 153.54,74.76 150.04,71.26 147.54,71.26 146.54,72.26 146.54,72.76 128.54,90.76 105.54,90.76 96.54,99.76 92.04,99.76 91.54,99.26 90.54,99.26 90.04,98.76 SV1.13 | v162.54,69.26 OJ72.1
  Bottom 0.254: v162.54,69.26 160.54,69.26 157.04,72.76 v157.04,73.26
GPIO_09_D5  (via drill 0.3)
  Top 0.254: 163.04,75.76 164.54,75.76 VSLUE8.15 | 163.04,75.76 162.04,76.76 162.04,77.76 162.54,78.26 164.54,78.26 VSLUE8.17 | SV1.14 92.54,98.76 93.04,99.26 96.04,99.26 105.04,90.26 128.04,90.26 133.54,84.76 133.54,81.76 135.54,79.76 138.54,79.76 146.04,72.26 146.04,70.76 147.54,69.26 OJ69.1 148.04,69.26 150.54,66.76 158.04,66.76 160.54,69.26 160.54,72.26 v160.04,72.76 | v162.54,75.26 163.04,75.76
  Bottom 0.254: v160.04,72.76 v162.54,75.26
GPIO_010_B6  (via drill 0.3)
  Top 0.254: IC7.27 186.04,135.76 185.04,136.76 180.04,136.76 173.04,129.76 147.54,129.76 146.04,128.26 v146.04,126.26 | v103.04,102.76 102.54,103.26 v101.54,103.26
  Bottom 0.254: v146.04,126.26 144.54,124.76 128.54,124.76 119.54,115.76 116.04,115.76 v103.04,102.76 | v101.54,103.26 100.04,101.76 95.54,101.76 94.04,100.26 94.04,98.76 92.54,97.26 92.04,97.26 91.04,96.26 90.04,96.26 SV1.15
GPIO_10_F13  (via drill 0.3)
  Top 0.254: IC6.34 168.54,131.76 169.54,130.76 v170.04,130.76 | v101.54,63.76 100.54,62.76 100.54,48.26 94.54,42.26 91.54,42.26 90.54,41.26 89.54,41.26 88.54,40.26 85.04,40.26 84.04,39.26 79.04,39.26 77.54,40.76 64.04,40.76 63.54,40.26 58.04,40.26 54.54,36.76 53.54,36.76 49.54,40.76 49.54,45.26 v43.54,51.26
  Bottom 0.254: v170.04,130.76 169.54,130.26 169.54,129.76 164.04,124.26 164.04,109.76 159.04,104.76 135.54,104.76 130.54,99.76 127.54,99.76 123.04,95.26 123.04,94.26 117.04,88.26 117.04,86.26 112.54,81.76 112.54,80.76 109.04,77.26 109.04,72.26 108.04,71.26 106.54,71.26 101.04,65.76 101.04,64.26 v101.54,63.76 | v43.54,51.26 43.54,63.26 46.04,65.76 SV2.2
GPIO_011_A6  (via drill 0.3)
  Top 0.254: IC7.26 185.54,131.26 v186.04,130.76 | v188.04,129.26 187.54,128.76 147.54,128.76 v147.04,128.26
  Bottom 0.254: v186.04,130.76 187.54,129.26 v188.04,129.26 | v147.04,128.26 144.04,125.26 128.04,125.26 119.04,116.26 115.54,116.26 95.04,95.76 92.54,95.76 SV1.16
GPIO_11_T15  (via drill 0.3)
  Top 0.254: v59.54,131.76 IC1.26 | v47.54,121.76 47.54,119.76 44.54,116.76 44.04,116.76 42.54,115.26 v42.54,92.76 | v43.04,85.76 44.54,84.26 44.54,76.26 v44.04,75.76
  Bottom 0.254: v59.54,131.76 54.04,126.26 52.04,126.26 v47.54,121.76 | v42.54,92.76 43.04,92.26 v43.04,85.76 | v44.04,75.76 43.54,75.26 43.54,70.76 46.04,68.26 SV2.4
GPIO_012_B7  (via drill 0.3)
  Top 0.254: v104.54,134.76 IC3.32 | v93.54,119.26 93.54,118.26 94.04,117.76 94.04,116.76 91.04,113.76 91.04,110.76 90.04,109.76 89.54,109.76 88.04,108.26 88.04,103.76 89.54,102.26 90.04,102.26 91.04,101.26 91.04,100.76 90.04,99.76 89.54,99.76 88.54,98.76 88.54,98.26 89.54,97.26 90.04,97.26 91.04,96.26 91.04,95.76 90.04,94.76 90.04,93.76 SV1.17
  Bottom 0.254: v104.54,134.76 105.54,133.76 105.54,131.76 101.04,127.26 101.04,125.76 94.54,119.26 v93.54,119.26
GPIO_12_T14  (via drill 0.3)
  Top 0.254: IC5.26 143.54,129.76 140.04,126.26 136.04,126.26 134.04,124.26 133.54,124.26 132.54,123.26 132.54,121.76 129.04,118.26 129.04,107.76 v129.54,107.26 | v92.54,63.26 87.04,63.26 84.54,65.76 81.04,65.76 71.54,75.26 54.04,75.26 49.04,70.26 SV2.5
  Bottom 0.254: v129.54,107.26 129.54,106.76 120.54,97.76 120.54,96.76 114.54,90.76 114.54,88.76 110.04,84.26 110.04,83.26 106.54,79.76 106.54,74.76 105.04,73.26 104.54,73.26 94.54,63.26 v92.54,63.26
GPIO_013_D6  (via drill 0.3)
  Top 0.254: VSLUE6.4 155.54,58.26 v157.04,58.26 157.54,58.76 157.54,60.26 157.04,60.76 155.54,60.76 VSLUE6.2 155.04,60.76 153.54,60.76 149.54,64.76 v146.54,64.76 | v94.04,94.76 94.04,94.26 94.54,93.76 94.54,90.76 115.54,69.76 128.54,69.76 v129.04,70.26 | OJ55.1 176.04,49.26 174.04,51.26 168.54,51.26 167.04,49.76 162.54,49.76 159.04,53.26 v159.04,55.76
  Bottom 0.254: v94.04,94.76 93.04,93.76 92.54,93.76 SV1.18 | v129.04,70.26 135.04,64.26 146.04,64.26 v146.54,64.76 | v159.04,55.76 157.04,57.76 v157.04,58.26
GPIO_13_T13  (via drill 0.3)
  Top 0.254: IC2.23 79.04,135.26 v79.54,135.76 | v59.04,91.76 v67.04,99.76 | v57.54,85.26 50.54,78.26 50.54,72.76 49.54,71.76 47.54,71.76 46.54,70.76 SV2.6
  Bottom 0.254: v79.54,135.76 79.04,135.26 79.04,116.76 73.04,110.76 73.04,106.76 68.04,101.76 68.04,100.76 v67.04,99.76 | v59.04,91.76 59.54,91.76 62.04,89.26 62.04,87.76 60.04,85.76 58.04,85.76 v57.54,85.26
GPIO_014_A7  (via drill 0.3)
  Top 0.254: IC2.35 85.04,118.76 v87.54,116.26 | v88.54,96.76 87.54,95.76 87.54,93.26 89.54,91.26 SV1.19
  Bottom 0.254: v87.54,116.26 87.54,107.76 88.04,107.26 88.04,97.26 v88.54,96.76
GPIO_14_R13  (via drill 0.3)
  Top 0.254: IC5.27 144.04,129.26 140.54,125.76 136.54,125.76 134.04,123.26 v133.54,123.26 | v124.54,118.76 125.54,117.76 125.54,109.26 125.04,108.76 125.04,103.26 v120.04,98.26 | v105.04,74.26 102.54,71.76 102.54,67.76 99.04,64.26 99.04,49.76 v94.54,45.26 | v85.04,54.76 84.54,54.26 54.54,54.26 52.54,56.26 52.54,62.76 47.54,62.76 44.04,66.26 44.04,69.76 46.04,71.76 46.54,71.76 47.54,72.76 48.54,72.76 SV2.7
  Bottom 0.254: v133.54,123.26 133.04,123.76 129.54,123.76 v124.54,118.76 | v120.04,98.26 120.04,97.26 114.04,91.26 114.04,89.26 109.54,84.76 109.54,83.76 106.04,80.26 106.04,75.26 v105.04,74.26 | v85.04,54.76 v94.54,45.26
GPIO_015_C6
  Top 0.254: 157.54,53.76 157.04,53.26 155.54,53.26 VSLUE6.8 | 157.54,53.76 157.54,55.26 157.04,55.76 155.54,55.76 VSLUE6.6 155.04,55.76 154.04,55.76 151.54,53.26 151.54,52.76 150.04,51.26 132.04,51.26 92.54,90.76 SV1.20 | OJ56.1 162.04,49.26 157.54,53.76
GPIO_15_T12  (via drill 0.3)
  Top 0.254: IC4.24 121.54,135.26 v122.04,135.76 | v115.04,126.26 114.04,125.26 114.04,99.26 v110.54,95.76 | v99.04,78.26 98.54,77.76 98.54,71.76 94.54,67.76 94.54,66.76 95.54,65.76 95.54,53.26 93.04,53.26 92.04,52.26 91.04,52.26 89.54,53.76 43.54,53.76 43.54,70.26 46.04,72.76 SV2.8
  Bottom 0.254: v122.04,135.76 114.04,127.76 114.04,127.26 v115.04,126.26 | v110.54,95.76 110.04,95.26 110.04,93.26 105.54,88.76 105.54,87.76 101.04,83.26 101.04,80.26 v99.04,78.26
GPIO_016_C8  (via drill 0.3)
  Top 0.254: 162.54,56.76 162.54,57.76 163.04,58.26 164.54,58.26 VSLUE6.17 | 162.54,56.76 162.54,56.26 163.04,55.76 164.54,55.76 VSLUE6.15 | SV1.21 90.04,88.26 91.04,87.26 95.04,87.26 131.54,50.76 146.04,50.76 147.54,49.26 OJ53.1 | v157.04,56.76 162.54,56.76
  Bottom 0.254: v157.04,56.76 151.54,51.26 150.04,51.26 148.04,49.26 OJ53.1
GPIO_16_R12  (via drill 0.3)
  Top 0.254: v121.04,135.76 IC4.23 | v113.54,125.76 113.54,99.76 v109.54,95.76 | v86.04,65.26 85.04,66.26 81.54,66.26 72.04,75.76 v51.54,75.76
  Bottom 0.254: v121.04,135.76 113.04,127.76 113.04,126.26 v113.54,125.76 | v109.54,95.76 109.54,93.76 105.04,89.26 105.04,88.26 100.54,83.76 100.54,81.26 96.54,77.26 93.04,77.26 92.54,76.76 92.04,76.76 91.04,75.76 91.04,75.26 90.04,74.26 89.54,74.26 88.54,73.26 88.54,72.76 89.54,71.76 90.04,71.76 91.04,70.76 91.04,70.26 92.04,69.26 92.54,69.26 94.04,67.76 94.04,65.76 91.54,63.26 90.04,63.26 88.04,65.26 v86.04,65.26 | v51.54,75.76 49.04,75.76 SV2.9
GPIO_017_E6  (via drill 0.3)
  Top 0.254: 167.54,51.76 167.54,52.76 167.04,53.26 165.04,53.26 VSLUE6.13 | 167.54,51.76 167.54,51.26 167.04,50.76 165.04,50.76 VSLUE6.11 | v99.04,81.76 99.54,81.76 132.04,49.26 OJ54.1 133.04,49.26 135.04,47.26 150.04,47.26 151.04,48.26 152.04,47.26 187.04,47.26 188.04,48.26 188.04,50.26 187.54,50.76 186.04,50.76 185.04,49.76 176.54,49.76 174.54,51.76 167.54,51.76
  Bottom 0.254: v99.04,81.76 97.54,81.76 95.54,83.76 95.54,84.26 94.04,85.76 94.04,86.76 92.54,88.26 SV1.22
GPIO_17_T11  (via drill 0.3)
  Top 0.254: v32.04,101.26 13.54,119.76 12.04,119.76 10.54,121.26 10.54,122.76 16.54,128.76 16.54,130.76 17.04,131.26 J3.3
  Bottom 0.254: v32.04,101.26 31.54,100.76 31.54,75.26 39.54,67.26 43.04,70.76 43.04,75.76 44.04,76.76 45.04,75.76 46.04,75.76 SV2.10
GPIO_018_E7  (via drill 0.3)
  Top 0.254: IC6.23 163.04,135.76 160.04,135.76 159.04,136.76 149.54,136.76 149.04,136.26 148.04,136.26 v147.04,135.26 | v133.04,127.26 128.04,122.26 128.04,106.76 127.54,106.26 127.54,100.76 121.54,94.76 109.54,94.76 106.54,97.76 v104.54,97.76
  Bottom 0.254: v147.04,135.26 138.54,126.76 133.54,126.76 v133.04,127.26 | v104.54,97.76 103.04,96.26 103.04,94.26 98.04,89.26 91.54,89.26 91.04,88.76 91.04,87.26 89.54,85.76 SV1.23
GPIO_18_T10  (via drill 0.3)
  Top 0.254: v106.04,135.76 IC3.35 | v82.04,112.76 82.04,109.76 v81.54,109.26 | v64.04,91.76 61.04,88.76 v61.04,87.76 | v57.54,87.26 50.54,80.26 49.04,80.26 SV2.13
  Bottom 0.254: v106.04,135.76 106.04,127.76 96.04,117.76 94.04,117.76 93.04,118.76 88.04,118.76 v82.04,112.76 | v81.54,109.26 78.04,105.76 78.04,103.76 66.04,91.76 v64.04,91.76 | v61.04,87.76 59.54,86.26 58.54,86.26 v57.54,87.26
GPIO_019_D8  (via drill 0.3)
  Top 0.254: v91.04,89.76 89.54,89.76 88.54,88.76 88.54,87.76 89.54,86.76 91.04,86.76 92.04,85.76 SV1.24 | v102.54,99.76 99.04,103.26 99.04,104.26 98.54,104.76 98.54,111.76 98.04,112.26 98.04,114.76 101.54,118.26 101.54,121.76 v105.04,125.26 | v92.54,156.76 90.04,159.26 29.54,159.26 26.54,156.26 J4.3
  Bottom 0.254: v91.04,89.76 97.54,89.76 102.54,94.76 v102.54,99.76 | v105.04,125.26 105.04,125.76 106.54,127.26 106.54,135.26 107.04,135.76 92.54,150.26 v92.54,156.76
GPIO_19_R11  (via drill 0.3)
  Top 0.254: IC6.35 169.04,134.76 v169.54,135.26 | v100.54,63.76 100.04,63.26 100.04,48.76 94.54,43.26 v93.54,44.26 | v76.04,55.26 75.54,55.76 75.54,59.26 60.54,74.26 56.04,74.26 v54.54,72.76
  Bottom 0.254: v169.54,135.26 169.54,131.26 169.04,130.76 169.04,130.26 164.04,125.26 156.04,125.26 141.04,110.26 141.04,106.26 140.04,105.26 132.04,105.26 122.54,95.76 122.54,94.76 116.54,88.76 116.54,86.76 112.04,82.26 112.04,81.26 108.54,77.76 108.54,72.76 107.54,71.76 106.04,71.76 100.54,66.26 v100.54,63.76 | v93.54,44.26 89.54,48.26 82.54,48.26 76.04,54.76 v76.04,55.26 | v54.54,72.76 52.54,74.76 52.54,76.26 49.54,79.26 49.04,79.26 48.04,80.26 46.54,80.26 SV2.14
GPIO_20_A14  (via drill 0.3)
  Top 0.254: v127.04,135.26 IC4.35 | v115.04,125.26 114.54,124.76 114.54,98.76 113.04,97.26 v113.04,96.26 | v95.54,66.76 96.04,66.26 96.04,52.76 93.54,52.76 v88.04,47.26
  Bottom 0.254: v127.04,135.26 124.54,132.76 122.54,132.76 v115.04,125.26 | v113.04,96.26 111.04,94.26 111.04,92.26 106.54,87.76 106.54,86.76 102.04,82.26 102.04,79.26 96.04,73.26 96.04,67.26 v95.54,66.76 | v88.04,47.26 87.54,47.76 81.54,47.76 79.54,45.76 J1.5
GPIO_020_E8  (via drill 0.3)
  Top 0.254: IC1.24 58.54,131.26 v61.54,128.26 | v70.54,119.26 76.54,119.26 83.04,112.76 83.04,107.76 82.54,107.26 82.54,67.76 87.54,67.76 87.54,80.76 89.54,82.76 SV1.25
  Bottom 0.254: v70.54,119.26 v61.54,128.26
GPIO_21_B16  (via drill 0.3)
  Top 0.254: v72.54,52.26 v76.54,48.26
  Bottom 0.254: v76.54,48.26 76.54,47.76 78.04,46.26 78.04,45.26 78.54,44.76 78.54,43.76 79.04,43.26 J1.6 | v72.54,52.26 72.54,53.76 70.54,55.76 70.54,59.26 56.04,73.76 56.04,87.76 49.04,94.76 48.54,94.76 47.54,95.76 47.54,96.26 46.54,97.26 46.04,97.26 32.54,110.76 32.54,147.76 24.04,156.26 J4.4
GPIO_021_F8  (via drill 0.3)
  Top 0.254: IC5.35 148.04,132.26 v148.54,131.76 | v136.54,138.26 136.54,137.26 134.54,135.26 134.54,134.26 136.54,132.26 137.04,132.26 138.04,131.26 128.54,121.76 128.54,106.26 128.04,105.76 128.04,100.26 122.04,94.26 109.04,94.26 v108.54,94.76 | v94.54,81.76 93.54,82.76 92.54,82.76 SV1.26
  Bottom 0.254: v148.54,131.76 148.54,133.76 149.54,134.76 149.54,138.26 150.54,139.26 150.54,150.26 152.54,152.26 152.54,155.76 151.54,156.76 151.04,156.76 150.04,155.76 150.04,154.76 149.54,154.26 148.54,154.26 147.54,153.26 147.54,152.26 136.04,140.76 136.04,138.76 v136.54,138.26 | v108.54,94.76 108.54,93.76 102.54,87.76 102.54,86.76 100.04,84.26 100.04,81.76 99.04,80.76 95.54,80.76 v94.54,81.76
GPIO_22_C14  (via drill 0.3)
  Top 0.254: IC8.26 206.54,135.26 205.54,136.26 v204.04,136.26 | v86.54,34.76 81.04,34.76 v76.54,39.26
  Bottom 0.254: v204.04,136.26 209.04,141.26 209.04,151.26 208.04,152.26 208.04,153.26 209.04,154.26 210.04,154.26 210.54,154.76 210.54,155.76 211.54,156.76 212.04,156.76 213.04,155.76 213.04,152.76 214.54,151.26 214.54,132.76 195.54,113.76 195.54,110.76 191.54,106.76 191.54,100.76 176.54,85.76 176.54,80.76 168.54,72.76 168.54,71.76 164.54,67.76 160.54,67.76 156.54,63.76 147.54,63.76 147.04,63.26 123.04,63.26 97.54,37.76 89.54,37.76 v86.54,34.76 | v76.54,39.26 77.54,40.26 77.54,42.26 78.04,42.76 78.04,43.76 77.54,44.26 77.54,45.26 77.04,45.76 J1.7
GPIO_022_F9  (via drill 0.3)
  Top 0.254: v188.04,136.76 IC7.31 | v176.54,120.76 v176.54,125.26 | v132.54,83.76 127.04,89.26 97.04,89.26 v95.54,90.76 | v93.04,91.76 92.54,92.26 92.04,92.26 91.54,91.76 v90.54,91.76 | v88.04,89.26 88.04,85.76 89.54,84.26 90.54,84.26 91.04,83.76 91.04,82.26 89.54,80.76 SV1.27
  Bottom 0.254: v176.54,125.26 v188.04,136.76 | v176.54,120.76 171.54,115.76 171.54,115.26 170.04,113.76 170.04,111.76 161.54,103.26 154.04,103.26 137.04,86.26 135.04,86.26 v132.54,83.76 | v95.54,90.76 94.54,91.76 v93.04,91.76 | v90.54,91.76 90.04,92.26 89.54,92.26 88.04,90.76 v88.04,89.26
GPIO_23_C16  (via drill 0.3)
  Top 0.254: IC6.24 163.54,134.76 v164.04,135.26 | v83.04,42.26 82.54,41.76 78.04,41.76 77.04,42.76 J1.8
  Bottom 0.254: v164.04,135.26 167.54,135.26 168.04,135.76 169.04,134.76 169.04,133.76 168.54,133.26 168.54,130.76 166.54,128.76 155.54,128.76 140.54,113.76 140.54,106.76 139.54,105.76 131.54,105.76 122.04,96.26 122.04,95.26 116.04,89.26 116.04,87.26 111.54,82.76 111.54,81.76 108.04,78.26 108.04,73.26 107.04,72.26 105.54,72.26 95.54,62.26 95.54,44.26 92.04,40.76 84.54,40.76 v83.04,42.26
GPIO_023_E9  (via drill 0.3)
  Top 0.254: v102.04,101.76 99.54,104.26 99.54,111.76 98.54,112.76 98.54,114.26 102.04,117.76 102.04,121.26 v107.04,126.26 | v98.54,157.26 96.54,159.26 v91.04,159.26 | v30.04,158.26 30.04,156.76 29.54,156.26 J4.2
  Bottom 0.254: v102.04,101.76 92.54,92.26 92.04,92.26 91.04,91.26 91.04,90.76 90.04,89.76 89.54,89.76 87.54,87.76 87.54,83.76 89.04,82.26 89.54,82.26 91.04,80.76 92.04,80.76 SV1.28 | v107.04,126.26 107.04,130.26 108.54,131.76 108.54,150.26 110.54,152.26 110.54,155.76 108.54,157.76 99.04,157.76 v98.54,157.26 | v91.04,159.26 31.04,159.26 v30.04,158.26
GPIO_024_C9  (via drill 0.3)
  Top 0.254: v122.54,134.76 IC4.26 | v115.04,127.26 114.54,127.76 107.54,127.76 106.04,126.26 105.04,126.26 101.04,122.26 101.04,118.76 97.54,115.26 97.54,111.76 98.04,111.26 98.04,104.26 98.54,103.76 98.54,102.76 v104.54,96.76 | v95.04,86.26 95.04,85.76 94.54,85.26 94.54,82.76 95.54,81.76 95.54,79.26 93.54,77.26 93.04,77.26 92.54,76.76 92.04,76.76 91.04,75.76 90.04,75.76 SV1.31
  Bottom 0.254: v122.54,134.76 122.04,134.76 115.04,127.76 v115.04,127.26 | v104.54,96.76 103.54,95.76 103.54,93.76 96.04,86.26 v95.04,86.26
GPIO_24_C15  (via drill 0.3)
  Top 0.254: v207.04,136.76 IC8.27 | v190.04,111.26 191.04,110.26 191.04,69.26 186.54,64.76 170.04,64.76 v169.54,65.26 | v151.04,47.26 150.54,46.76 101.04,46.76 96.04,41.76 93.04,41.76 92.04,40.76 90.04,40.76 89.04,39.76 85.54,39.76 84.54,38.76 v78.54,38.76
  Bottom 0.254: v207.04,136.76 207.04,129.26 190.04,112.26 v190.04,111.26 | v169.54,65.26 151.54,47.26 v151.04,47.26 | v78.54,38.76 77.54,37.76 76.04,37.76 72.54,41.26 72.54,42.26 73.04,42.76 73.04,43.76 74.04,44.76 74.04,45.76 J1.9
GPIO_025_D9  (via drill 0.3)
  Top 0.254: v123.04,131.26 IC4.27 | v120.04,128.26 107.04,128.26 105.54,126.76 104.54,126.76 100.54,122.76 100.54,119.26 97.04,115.76 97.04,103.26 v104.54,95.76 | v95.54,85.26 95.54,84.76 95.04,84.26 95.04,83.26 96.04,82.26 96.04,78.76 92.54,75.26 SV1.32
  Bottom 0.254: v120.04,128.26 v123.04,131.26 | v104.54,95.76 104.04,95.26 104.04,93.26 96.04,85.26 v95.54,85.26
GPIO_25_D16  (via drill 0.3)
  Top 0.254: v211.04,134.76 IC8.35 | v83.54,37.76 v85.04,36.26 | v81.04,44.76 80.54,45.26 80.54,46.26 79.04,47.76 77.04,47.76 75.54,46.26 75.54,45.26 74.54,44.26 74.54,43.26 J1.10
  Bottom 0.254: v211.04,134.76 210.54,134.76 209.54,135.76 211.54,137.76 213.04,137.76 214.04,136.76 214.04,133.26 191.04,110.26 191.04,109.26 185.54,103.76 179.54,103.76 168.04,92.26 168.04,91.26 165.04,88.26 153.04,88.26 148.04,83.26 140.04,83.26 96.04,39.26 88.04,39.26 v85.04,36.26 | v83.54,37.76 83.54,39.76 80.54,42.76 80.54,43.76 81.04,44.26 v81.04,44.76
GPIO_26_D15  (via drill 0.3)
  Top 0.254: v205.54,134.76 IC8.24 | v195.54,124.76 195.04,124.26 195.04,113.26 193.54,111.76 193.54,76.76 v194.04,76.26 | v151.04,46.26 101.54,46.26 96.54,41.26 93.54,41.26 92.54,40.26 90.54,40.26 85.54,35.26 82.04,35.26 v81.04,36.26
  Bottom 0.254: v195.54,124.76 v205.54,134.76 | v194.04,76.26 189.04,71.26 186.04,71.26 161.04,46.26 v151.04,46.26 | v81.04,36.26 80.54,35.76 77.04,35.76 71.04,41.76 71.04,42.26 70.54,42.76 70.54,43.76 71.54,44.76 71.54,45.76 J1.11
GPIO_026_E11  (via drill 0.3)
  Top 0.254: v165.04,131.76 IC6.27 | v131.54,126.76 127.54,122.76 127.54,107.26 127.04,106.76 127.04,101.26 121.04,95.26 112.04,95.26 v111.54,95.76
  Bottom 0.254: v165.04,131.76 164.04,130.76 144.54,130.76 140.04,126.26 132.04,126.26 v131.54,126.76 | v111.54,95.76 110.54,94.76 110.54,92.76 106.04,88.26 106.04,87.26 101.54,82.76 101.54,79.76 95.54,73.76 93.04,73.76 92.54,74.26 92.04,74.26 91.54,73.76 90.54,73.76 90.04,73.26 SV1.33
GPIO_27_D14  (via drill 0.3)